# Altium project SDR2.PrjPcb (part 1 of 2)
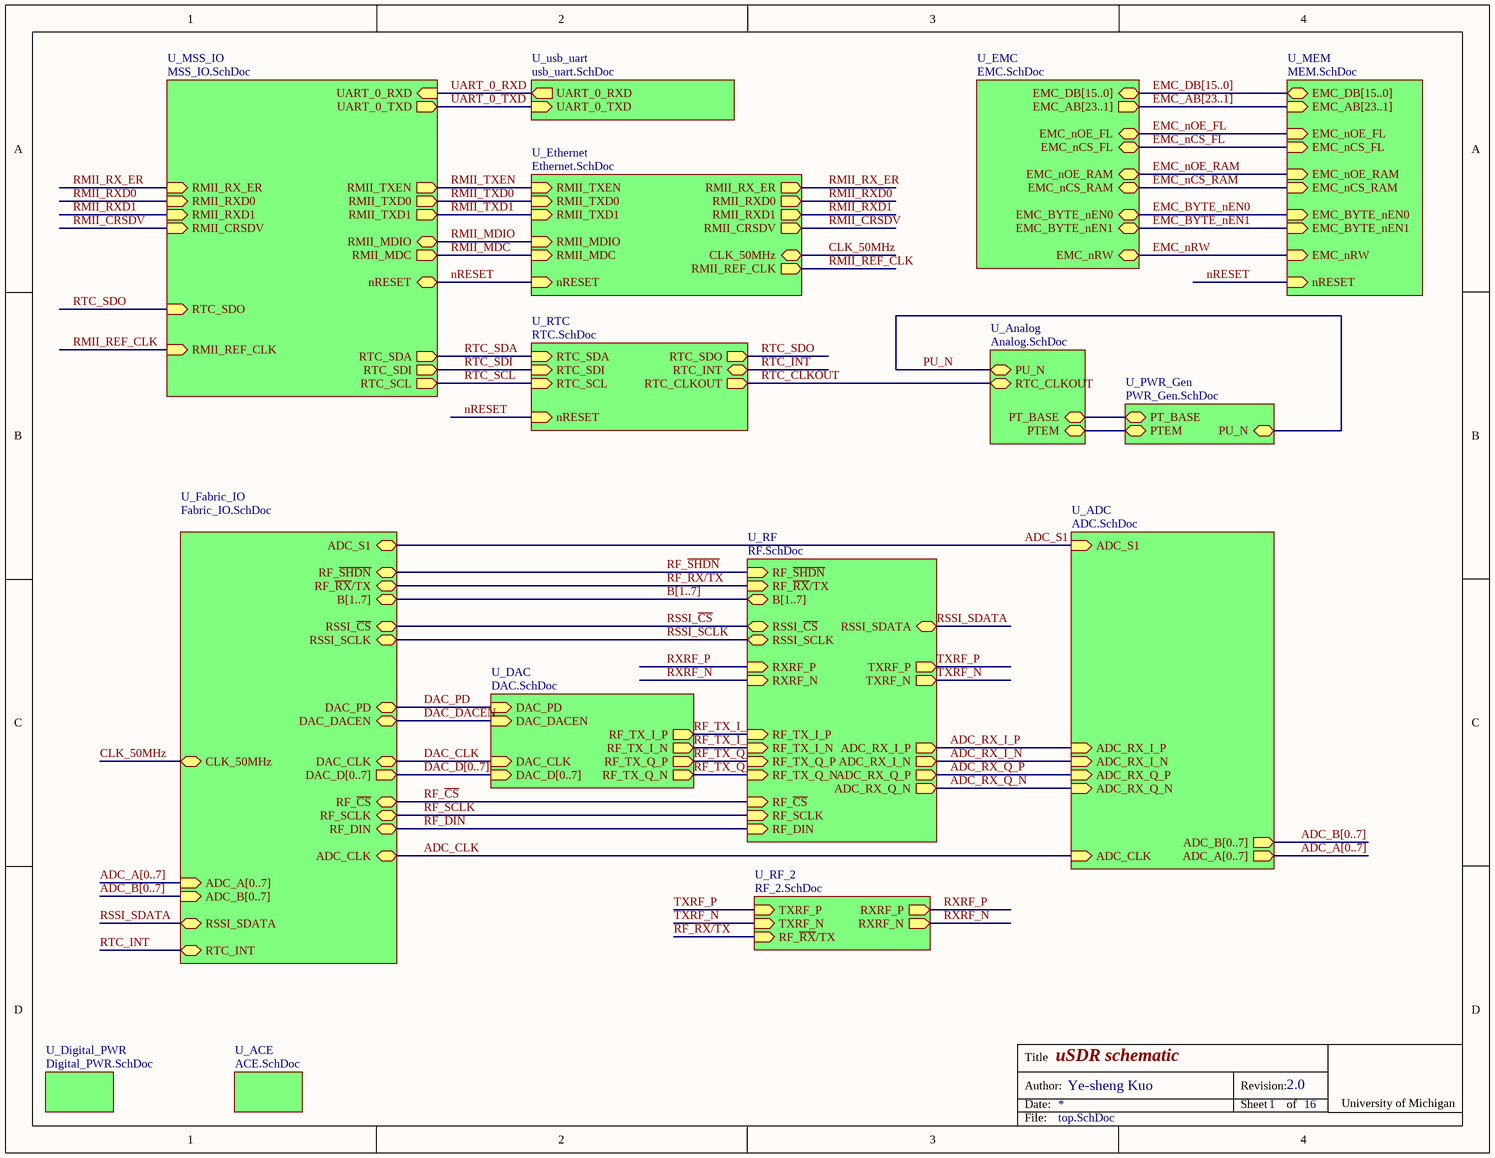
[diagram p0: top.SchDoc]
16 sheets, 401 parts. Net scope: hierarchical (ports join the sheet entries above them; power ports are global).
Board file: SDR.PcbDoc
Sheets:
  top.SchDoc
    U_EMC = EMC.SchDoc
    U_MEM = MEM.SchDoc
    U_Digital_PWR = Digital_PWR.SchDoc
    U_Analog = Analog.SchDoc
    U_usb_uart = usb_uart.SchDoc
    U_ACE = ACE.SchDoc
    U_Fabric_IO = Fabric_IO.SchDoc
    U_MSS_IO = MSS_IO.SchDoc
    U_ADC = ADC.SchDoc
    U_Ethernet = Ethernet.SchDoc
    U_DAC = DAC.SchDoc
    U_RF = RF.SchDoc
    U_PWR_Gen = PWR_Gen.SchDoc
    U_RF_2 = RF_2.SchDoc
    U_RTC = RTC.SchDoc

## Sheet top.SchDoc: uSDR schematic
size Letter; Author: Ye-sheng Kuo; CompanyName: Univ. of Michigan; DrawnBy: Ye-sheng Kuo; Revision: 2.0; SheetNumber: 1; SheetTotal: 16

### Sub-sheets
U_ACE = ACE.SchDoc: no entries
U_ADC = ADC.SchDoc: ADC_CLK (in), ADC_A[0..7] (out), ADC_B[0..7] (out), ADC_RX_Q_P (in), ADC_RX_Q_N (in), ADC_RX_I_N (in), ADC_RX_I_P (in), ADC_S1 (in)
U_Analog = Analog.SchDoc: PU_N, PT_BASE, PTEM, RTC_CLKOUT
U_DAC = DAC.SchDoc: DAC_D[0..7] (in), DAC_CLK (in), DAC_DACEN (in), DAC_PD (in), RF_TX_I_P (out), RF_TX_I_N (out), RF_TX_Q_P (out), RF_TX_Q_N (out)
U_Digital_PWR = Digital_PWR.SchDoc: no entries
U_EMC = EMC.SchDoc: EMC_AB[23..1] (out), EMC_DB[15..0] (bidir), EMC_nOE_FL (bidir), EMC_nOE_RAM (bidir), EMC_nRW (bidir), EMC_nCS_FL (bidir), EMC_nCS_RAM (bidir), EMC_BYTE_nEN1 (bidir), EMC_BYTE_nEN0 (bidir)
U_Ethernet = Ethernet.SchDoc: RMII_TXD0 (in), RMII_TXD1 (in), RMII_RXD0 (out), RMII_RXD1 (out), RMII_CRSDV (out), RMII_RX_ER (out), RMII_MDIO (in), RMII_MDC (in), nRESET (in), RMII_TXEN (in), CLK_50MHz (bidir), RMII_REF_CLK (out)
U_Fabric_IO = Fabric_IO.SchDoc: DAC_D[0..7] (out), DAC_CLK (bidir), ADC_CLK (bidir), RF_SCLK (bidir), RF_DIN (bidir), CLK_50MHz (bidir), RF_~{CS} (bidir), ADC_A[0..7] (in), ADC_B[0..7] (in), DAC_PD (bidir), DAC_DACEN (bidir), RF_~{RX}/TX (bidir), ADC_S1 (bidir), RF_~{SHDN} (bidir), B[1..7] (bidir), RSSI_SCLK (bidir), RSSI_~{CS} (bidir), RSSI_SDATA (bidir), RTC_INT (bidir)
U_MEM = MEM.SchDoc: EMC_nCS_RAM (in), EMC_nRW (in), EMC_nOE_RAM (in), EMC_BYTE_nEN1 (in), EMC_BYTE_nEN0 (in), EMC_nOE_FL (in), EMC_nCS_FL (in), EMC_AB[23..1] (in), EMC_DB[15..0] (bidir), nRESET (in)
U_MSS_IO = MSS_IO.SchDoc: UART_0_RXD (in), UART_0_TXD (out), nRESET (bidir), RMII_TXD0 (out), RMII_TXD1 (out), RMII_RXD0 (in), RMII_RXD1 (in), RMII_RX_ER (in), RMII_MDIO (bidir), RMII_MDC (out), RMII_TXEN (out), RMII_CRSDV (in), RMII_REF_CLK (in), RTC_SDI (out), RTC_SDO (in), RTC_SCL (out), RTC_SDA (out)
U_PWR_Gen = PWR_Gen.SchDoc: PTEM, PT_BASE, PU_N
U_RF = RF.SchDoc: RF_~{SHDN} (in), RF_~{CS} (in), RF_SCLK (in), RF_DIN (in), ADC_RX_Q_N (out), RF_~{RX}/TX (in), RF_TX_I_P (in), RF_TX_I_N (in), RF_TX_Q_P (in), RF_TX_Q_N (in), ADC_RX_I_P (out), ADC_RX_I_N (out), ADC_RX_Q_P (out), RXRF_N (in), RXRF_P (in), TXRF_P (out), TXRF_N (out), RSSI_~{CS} (bidir), RSSI_SDATA (bidir), RSSI_SCLK (bidir), B[1..7] (bidir)
U_RF_2 = RF_2.SchDoc: RF_~{RX}/TX (in), TXRF_N (in), TXRF_P (in), RXRF_P (out), RXRF_N (out)
U_RTC = RTC.SchDoc: RTC_SDA (in), RTC_SDO (out), RTC_SDI (in), RTC_SCL (in), RTC_INT (bidir), RTC_CLKOUT, nRESET (in)
U_usb_uart = usb_uart.SchDoc: UART_0_TXD (in), UART_0_RXD (out)

### Nets
ADC_CLK: sheet U_Fabric_IO/ADC_CLK, sheet U_ADC/ADC_CLK
ADC_RX_I_N: sheet U_ADC/ADC_RX_I_N, sheet U_RF/ADC_RX_I_N
ADC_RX_I_P: sheet U_ADC/ADC_RX_I_P, sheet U_RF/ADC_RX_I_P
ADC_RX_Q_N: sheet U_ADC/ADC_RX_Q_N, sheet U_RF/ADC_RX_Q_N
ADC_RX_Q_P: sheet U_ADC/ADC_RX_Q_P, sheet U_RF/ADC_RX_Q_P
ADC_S1: sheet U_Fabric_IO/ADC_S1, sheet U_ADC/ADC_S1
CLK_50MHz: sheet U_Fabric_IO/CLK_50MHz, sheet U_Ethernet/CLK_50MHz
DAC_CLK: sheet U_Fabric_IO/DAC_CLK, sheet U_DAC/DAC_CLK
DAC_DACEN: sheet U_Fabric_IO/DAC_DACEN, sheet U_DAC/DAC_DACEN
DAC_PD: sheet U_Fabric_IO/DAC_PD, sheet U_DAC/DAC_PD
EMC_BYTE_nEN0: sheet U_EMC/EMC_BYTE_nEN0, sheet U_MEM/EMC_BYTE_nEN0
EMC_BYTE_nEN1: sheet U_EMC/EMC_BYTE_nEN1, sheet U_MEM/EMC_BYTE_nEN1
EMC_nCS_FL: sheet U_EMC/EMC_nCS_FL, sheet U_MEM/EMC_nCS_FL
EMC_nCS_RAM: sheet U_EMC/EMC_nCS_RAM, sheet U_MEM/EMC_nCS_RAM
EMC_nOE_FL: sheet U_EMC/EMC_nOE_FL, sheet U_MEM/EMC_nOE_FL
EMC_nOE_RAM: sheet U_EMC/EMC_nOE_RAM, sheet U_MEM/EMC_nOE_RAM
EMC_nRW: sheet U_EMC/EMC_nRW, sheet U_MEM/EMC_nRW
nRESET: sheet U_MEM/nRESET, sheet U_MSS_IO/nRESET, sheet U_Ethernet/nRESET, sheet U_RTC/nRESET
PU_N: sheet U_Analog/PU_N, sheet U_PWR_Gen/PU_N
RF_~{CS}: sheet U_Fabric_IO/RF_~{CS}, sheet U_RF/RF_~{CS}
RF_DIN: sheet U_Fabric_IO/RF_DIN, sheet U_RF/RF_DIN
RF_~{RX}/TX: sheet U_Fabric_IO/RF_~{RX}/TX, sheet U_RF/RF_~{RX}/TX, sheet U_RF_2/RF_~{RX}/TX
RF_~{SHDN}: sheet U_Fabric_IO/RF_~{SHDN}, sheet U_RF/RF_~{SHDN}
RF_SCLK: sheet U_Fabric_IO/RF_SCLK, sheet U_RF/RF_SCLK
RF_TX_I_N: sheet U_DAC/RF_TX_I_N, sheet U_RF/RF_TX_I_N
RF_TX_I_P: sheet U_DAC/RF_TX_I_P, sheet U_RF/RF_TX_I_P
RF_TX_Q_N: sheet U_DAC/RF_TX_Q_N, sheet U_RF/RF_TX_Q_N
RF_TX_Q_P: sheet U_DAC/RF_TX_Q_P, sheet U_RF/RF_TX_Q_P
RMII_CRSDV: sheet U_MSS_IO/RMII_CRSDV, sheet U_Ethernet/RMII_CRSDV
RMII_MDC: sheet U_MSS_IO/RMII_MDC, sheet U_Ethernet/RMII_MDC
RMII_MDIO: sheet U_MSS_IO/RMII_MDIO, sheet U_Ethernet/RMII_MDIO
RMII_REF_CLK: sheet U_MSS_IO/RMII_REF_CLK, sheet U_Ethernet/RMII_REF_CLK
RMII_RX_ER: sheet U_MSS_IO/RMII_RX_ER, sheet U_Ethernet/RMII_RX_ER
RMII_RXD0: sheet U_MSS_IO/RMII_RXD0, sheet U_Ethernet/RMII_RXD0
RMII_RXD1: sheet U_MSS_IO/RMII_RXD1, sheet U_Ethernet/RMII_RXD1
RMII_TXD0: sheet U_MSS_IO/RMII_TXD0, sheet U_Ethernet/RMII_TXD0
RMII_TXD1: sheet U_MSS_IO/RMII_TXD1, sheet U_Ethernet/RMII_TXD1
RMII_TXEN: sheet U_MSS_IO/RMII_TXEN, sheet U_Ethernet/RMII_TXEN
RSSI_~{CS}: sheet U_Fabric_IO/RSSI_~{CS}, sheet U_RF/RSSI_~{CS}
RSSI_SCLK: sheet U_Fabric_IO/RSSI_SCLK, sheet U_RF/RSSI_SCLK
RSSI_SDATA: sheet U_Fabric_IO/RSSI_SDATA, sheet U_RF/RSSI_SDATA
RTC_CLKOUT: sheet U_Analog/RTC_CLKOUT, sheet U_RTC/RTC_CLKOUT
RTC_INT: sheet U_Fabric_IO/RTC_INT, sheet U_RTC/RTC_INT
RTC_SCL: sheet U_MSS_IO/RTC_SCL, sheet U_RTC/RTC_SCL
RTC_SDA: sheet U_MSS_IO/RTC_SDA, sheet U_RTC/RTC_SDA
RTC_SDI: sheet U_MSS_IO/RTC_SDI, sheet U_RTC/RTC_SDI
RTC_SDO: sheet U_MSS_IO/RTC_SDO, sheet U_RTC/RTC_SDO
RXRF_N: sheet U_RF/RXRF_N, sheet U_RF_2/RXRF_N
RXRF_P: sheet U_RF/RXRF_P, sheet U_RF_2/RXRF_P
TXRF_N: sheet U_RF/TXRF_N, sheet U_RF_2/TXRF_N
TXRF_P: sheet U_RF/TXRF_P, sheet U_RF_2/TXRF_P
UART_0_RXD: sheet U_usb_uart/UART_0_RXD, sheet U_MSS_IO/UART_0_RXD
UART_0_TXD: sheet U_usb_uart/UART_0_TXD, sheet U_MSS_IO/UART_0_TXD
VCC1.5_INT: sheet U_Analog/PTEM, sheet U_PWR_Gen/PTEM
NetQ2_1: sheet U_Analog/PT_BASE, sheet U_PWR_Gen/PT_BASE

### Buses and harness runs
bus ADC_A[0..7] = sheet U_ADC/ADC_A[0..7]
bus ADC_A[0..7] = sheet U_Fabric_IO/ADC_A[0..7]
bus ADC_B[0..7] = sheet U_ADC/ADC_B[0..7]
bus ADC_B[0..7] = sheet U_Fabric_IO/ADC_B[0..7]
bus B[1..7] = sheet U_Fabric_IO/B[1..7] = sheet U_RF/B[1..7]
bus DAC_D[0..7] = sheet U_DAC/DAC_D[0..7] = sheet U_Fabric_IO/DAC_D[0..7]
bus EMC_AB[23..1] = sheet U_EMC/EMC_AB[23..1] = sheet U_MEM/EMC_AB[23..1]
bus EMC_DB[15..0] = sheet U_EMC/EMC_DB[15..0] = sheet U_MEM/EMC_DB[15..0]

### Notes on the sheet
- Title
- Date:
- Author:
- Revision:
- Sheet
- of
- University of Michigan
- File:

## Sheet EMC.SchDoc: uSDR schematic
size Letter; Author: Ye-sheng Kuo; CompanyName: Univ. of Michigan; Revision: 2.0; SheetNumber: 16; SheetTotal: 16
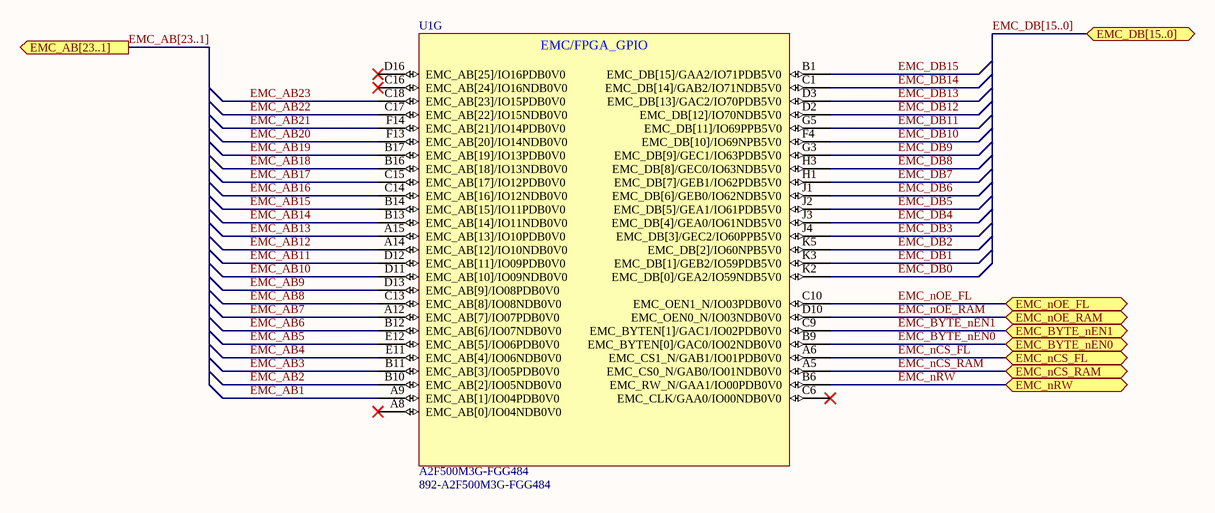
[diagram p1: EMC.SchDoc]

### Parts
U1  A2F500M3G-FGG484  Supplier Part Number 1: 892-A2F500M3G-FGG484  [BGA100P22X22-484N]  (part G of 13)

### Ports
EMC_AB[23..1] (out), EMC_BYTE_nEN0 (bidir), EMC_BYTE_nEN1 (bidir), EMC_DB[15..0] (bidir), EMC_nCS_FL (bidir), EMC_nCS_RAM (bidir), EMC_nOE_FL (bidir), EMC_nOE_RAM (bidir), EMC_nRW (bidir)

### Nets
EMC_AB1: U1.A9(EMC_AB[1]/IO04PDB0V0)
EMC_AB2: U1.B10(EMC_AB[2]/IO05NDB0V0)
EMC_AB3: U1.B11(EMC_AB[3]/IO05PDB0V0)
EMC_AB4: U1.E11(EMC_AB[4]/IO06NDB0V0)
EMC_AB5: U1.E12(EMC_AB[5]/IO06PDB0V0)
EMC_AB6: U1.B12(EMC_AB[6]/IO07NDB0V0)
EMC_AB7: U1.A12(EMC_AB[7]/IO07PDB0V0)
EMC_AB8: U1.C13(EMC_AB[8]/IO08NDB0V0)
EMC_AB9: U1.D13(EMC_AB[9]/IO08PDB0V0)
EMC_AB10: U1.D11(EMC_AB[10]/IO09NDB0V0)
EMC_AB11: U1.D12(EMC_AB[11]/IO09PDB0V0)
EMC_AB12: U1.A14(EMC_AB[12]/IO10NDB0V0)
EMC_AB13: U1.A15(EMC_AB[13]/IO10PDB0V0)
EMC_AB14: U1.B13(EMC_AB[14]/IO11NDB0V0)
EMC_AB15: U1.B14(EMC_AB[15]/IO11PDB0V0)
EMC_AB16: U1.C14(EMC_AB[16]/IO12NDB0V0)
EMC_AB17: U1.C15(EMC_AB[17]/IO12PDB0V0)
EMC_AB18: U1.B16(EMC_AB[18]/IO13NDB0V0)
EMC_AB19: U1.B17(EMC_AB[19]/IO13PDB0V0)
EMC_AB20: U1.F13(EMC_AB[20]/IO14NDB0V0)
EMC_AB21: U1.F14(EMC_AB[21]/IO14PDB0V0)
EMC_AB22: U1.C17(EMC_AB[22]/IO15NDB0V0)
EMC_AB23: U1.C18(EMC_AB[23]/IO15PDB0V0)
EMC_BYTE_nEN0: U1.B9(EMC_BYTEN[0]/GAC0/IO02NDB0V0) ; port EMC_BYTE_nEN0
EMC_BYTE_nEN1: U1.C9(EMC_BYTEN[1]/GAC1/IO02PDB0V0) ; port EMC_BYTE_nEN1
EMC_DB0: U1.K2(EMC_DB[0]/GEA2/IO59NDB5V0)
EMC_DB1: U1.K3(EMC_DB[1]/GEB2/IO59PDB5V0)
EMC_DB2: U1.K5(EMC_DB[2]/IO60NPB5V0)
EMC_DB3: U1.J4(EMC_DB[3]/GEC2/IO60PPB5V0)
EMC_DB4: U1.J3(EMC_DB[4]/GEA0/IO61NDB5V0)
EMC_DB5: U1.J2(EMC_DB[5]/GEA1/IO61PDB5V0)
EMC_DB6: U1.J1(EMC_DB[6]/GEB0/IO62NDB5V0)
EMC_DB7: U1.H1(EMC_DB[7]/GEB1/IO62PDB5V0)
EMC_DB8: U1.H3(EMC_DB[8]/GEC0/IO63NDB5V0)
EMC_DB9: U1.G3(EMC_DB[9]/GEC1/IO63PDB5V0)
EMC_DB10: U1.F4(EMC_DB[10]/IO69NPB5V0)
EMC_DB11: U1.G5(EMC_DB[11]/IO69PPB5V0)
EMC_DB12: U1.D2(EMC_DB[12]/IO70NDB5V0)
EMC_DB13: U1.D3(EMC_DB[13]/GAC2/IO70PDB5V0)
EMC_DB14: U1.C1(EMC_DB[14]/GAB2/IO71NDB5V0)
EMC_DB15: U1.B1(EMC_DB[15]/GAA2/IO71PDB5V0)
EMC_nCS_FL: U1.A6(EMC_CS1_N/GAB1/IO01PDB0V0) ; port EMC_nCS_FL
EMC_nCS_RAM: U1.A5(EMC_CS0_N/GAB0/IO01NDB0V0) ; port EMC_nCS_RAM
EMC_nOE_FL: U1.C10(EMC_OEN1_N/IO03PDB0V0) ; port EMC_nOE_FL
EMC_nOE_RAM: U1.D10(EMC_OEN0_N/IO03NDB0V0) ; port EMC_nOE_RAM
EMC_nRW: U1.B6(EMC_RW_N/GAA1/IO00PDB0V0) ; port EMC_nRW

Not connected (* = marked no-connect by the designer): U1 A8(EMC_AB[0]/IO04NDB0V0)* C6(EMC_CLK/GAA0/IO00NDB0V0)* C16(EMC_AB[24]/IO16NDB0V0)* D16(EMC_AB[25]/IO16PDB0V0)*

### Buses and harness runs
bus EMC_AB[23..1] = port EMC_AB[23..1]
bus EMC_DB[15..0] = port EMC_DB[15..0]

### Notes on the sheet
- Title
- Date:
- Author:
- Revision:
- Sheet
- of
- University of Michigan
- File:
- (in symbol F2-200_500-FGG484_1, part G) EMC/FPGA_GPIO

### Library data of the parts
U1 = F2-200_500-FGG484_1: FPGA - Field Programmable Gate Array 500K System Gates; PPS#: P0934R; Supplier 1: Mouser

## Sheet MEM.SchDoc: uSDR schematic
size Letter; Author: Ye-sheng Kuo; CompanyName: Univ. of Michigan; Revision: 2.0; SheetNumber: 15; SheetTotal: 16
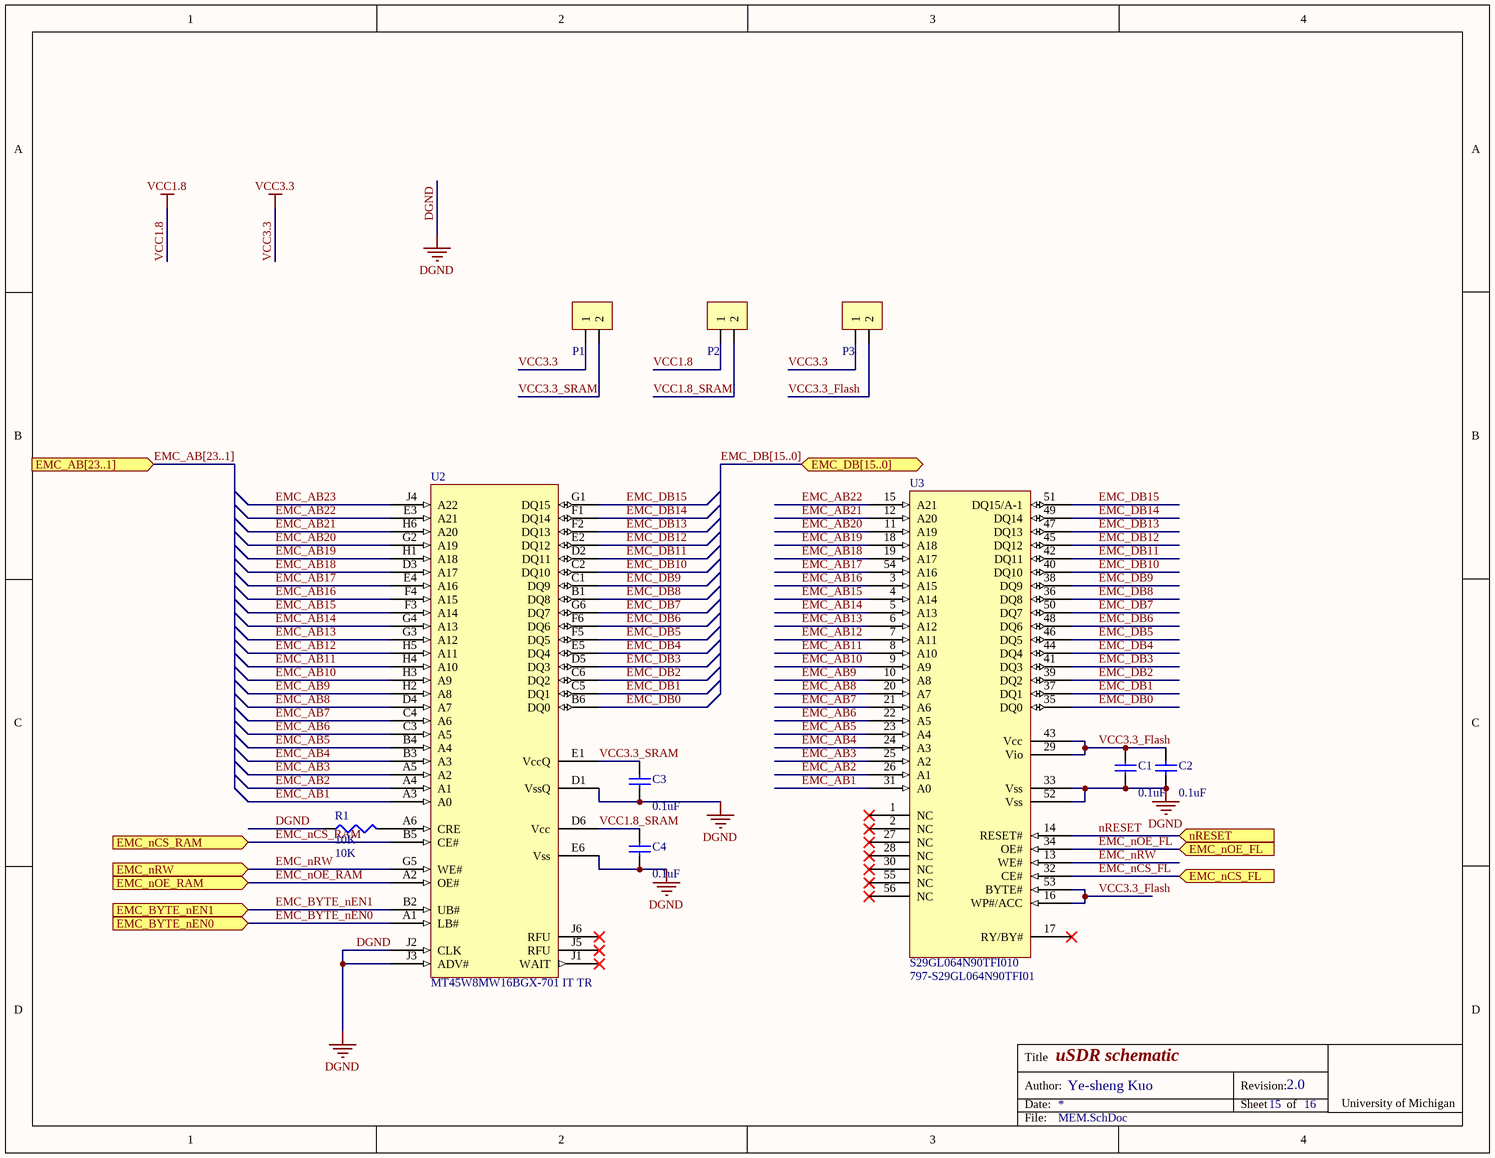
[diagram p2: MEM.SchDoc]

### Parts
C1  0.1uF  [0402]
C2  0.1uF  [0402]
C3  0.1uF  [0402]
C4  0.1uF  [0402]
P1  1 x 2 header  [1x2 header]  (value not drawn)
P2  1 x 2 header  [1x2 header]  (value not drawn)
P3  1 x 2 header  [1x2 header]  (value not drawn)
R1  10K  [0402]
U2  MT45W8MW16BGX-701 IT TR  [BGA54C75P9X6_1000X800X70]
U3  S29GL064N90TFI010  Supplier Part Number 1: 797-S29GL064N90TFI01  [TSSOP50P2000X120-56N]

### Ports
EMC_AB[23..1] (in), EMC_BYTE_nEN0 (in), EMC_BYTE_nEN1 (in), EMC_DB[15..0] (bidir), EMC_nCS_FL (in), EMC_nCS_RAM (in), EMC_nOE_FL (in), EMC_nOE_RAM (in), EMC_nRW (in), nRESET (in)

### Nets
DGND: C1.1 C2.1 C3.1 C4.1 R1.1 U2.D1(VssQ) U2.E6(Vss) U2.J2(CLK) U2.J3(ADV#) U3.33(Vss) U3.52(Vss)
VCC1.8: P2.1
VCC3.3: P1.1 P3.1
EMC_AB1: U2.A3(A0) U3.31(A0)
EMC_AB2: U2.A4(A1) U3.26(A1)
EMC_AB3: U2.A5(A2) U3.25(A2)
EMC_AB4: U2.B3(A3) U3.24(A3)
EMC_AB5: U2.B4(A4) U3.23(A4)
EMC_AB6: U2.C3(A5) U3.22(A5)
EMC_AB7: U2.C4(A6) U3.21(A6)
EMC_AB8: U2.D4(A7) U3.20(A7)
EMC_AB9: U2.H2(A8) U3.10(A8)
EMC_AB10: U2.H3(A9) U3.9(A9)
EMC_AB11: U2.H4(A10) U3.8(A10)
EMC_AB12: U2.H5(A11) U3.7(A11)
EMC_AB13: U2.G3(A12) U3.6(A12)
EMC_AB14: U2.G4(A13) U3.5(A13)
EMC_AB15: U2.F3(A14) U3.4(A14)
EMC_AB16: U2.F4(A15) U3.3(A15)
EMC_AB17: U2.E4(A16) U3.54(A16)
EMC_AB18: U2.D3(A17) U3.19(A17)
EMC_AB19: U2.H1(A18) U3.18(A18)
EMC_AB20: U2.G2(A19) U3.11(A19)
EMC_AB21: U2.H6(A20) U3.12(A20)
EMC_AB22: U2.E3(A21) U3.15(A21)
EMC_AB23: U2.J4(A22)
EMC_BYTE_nEN0: U2.A1(LB#) ; port EMC_BYTE_nEN0
EMC_BYTE_nEN1: U2.B2(UB#) ; port EMC_BYTE_nEN1
EMC_DB0: U2.B6(DQ0) U3.35(DQ0)
EMC_DB1: U2.C5(DQ1) U3.37(DQ1)
EMC_DB2: U2.C6(DQ2) U3.39(DQ2)
EMC_DB3: U2.D5(DQ3) U3.41(DQ3)
EMC_DB4: U2.E5(DQ4) U3.44(DQ4)
EMC_DB5: U2.F5(DQ5) U3.46(DQ5)
EMC_DB6: U2.F6(DQ6) U3.48(DQ6)
EMC_DB7: U2.G6(DQ7) U3.50(DQ7)
EMC_DB8: U2.B1(DQ8) U3.36(DQ8)
EMC_DB9: U2.C1(DQ9) U3.38(DQ9)
EMC_DB10: U2.C2(DQ10) U3.40(DQ10)
EMC_DB11: U2.D2(DQ11) U3.42(DQ11)
EMC_DB12: U2.E2(DQ12) U3.45(DQ12)
EMC_DB13: U2.F2(DQ13) U3.47(DQ13)
EMC_DB14: U2.F1(DQ14) U3.49(DQ14)
EMC_DB15: U2.G1(DQ15) U3.51(DQ15/A-1)
EMC_nCS_FL: U3.32(CE#) ; port EMC_nCS_FL
EMC_nCS_RAM: U2.B5(CE#) ; port EMC_nCS_RAM
EMC_nOE_FL: U3.34(OE#) ; port EMC_nOE_FL
EMC_nOE_RAM: U2.A2(OE#) ; port EMC_nOE_RAM
EMC_nRW: U2.G5(WE#) U3.13(WE#) ; port EMC_nRW
nRESET: U3.14(RESET#) ; port nRESET
VCC1.8_SRAM: C4.2 P2.2 U2.D6(Vcc)
VCC3.3_Flash: C1.2 C2.2 P3.2 U3.16(WP#/ACC) U3.29(Vio) U3.43(Vcc) U3.53(BYTE#)
VCC3.3_SRAM: C3.2 P1.2 U2.E1(VccQ)
NetR1_2: R1.2 U2.A6(CRE)

Not connected (* = marked no-connect by the designer): U2 J1(WAIT)* J5(RFU)* J6(RFU)*; U3 1(NC)* 2(NC)* 17(RY/BY#)* 27(NC)* 28(NC)* 30(NC)* 55(NC)* 56(NC)*

### Buses and harness runs
bus EMC_AB[23..1] = port EMC_AB[23..1]
bus EMC_DB[15..0] = port EMC_DB[15..0]

### Notes on the sheet
- Title
- Date:
- Author:
- Revision:
- Sheet
- of
- University of Michigan
- File:

### Library data of the parts
C1-C4 = Cap Semi: Capacitor (Semiconductor SIM Model); Published: 8-Jun-2000; LatestRevisionDate: 29-May-2009; LatestRevisionNote: IPC-7351 Footprint Added.; PackageReference: C1206; Publisher: Altium Limited; PackageDescription: Chip Capacitor; Value: 0.1uF
P1-P3 = 1 x 2 header: 100 mils standard header
R1 = Res3: Resistor; Published: 8-Jun-2000; LatestRevisionDate: 29-May-2009; LatestRevisionNote: IPC-7351 Footprint Added.; PackageReference: J1-0603; Publisher: Altium Limited; PackageDescription: Chip Resistor; Value: 10K
U2 = MT45W8MW16BGX-701 IT: IC PSRAM 128MBIT 70NS 54VFBGA; Supplier 1: Digi-Key; Supplier Part Number 1: 557-1444-1-ND
U3 = S29GL064N: Flash 3V 64Mb Float Gate highest address 90s; Supplier 1: Mouser

## Sheet Digital_PWR.SchDoc: uSDR schematic
size Letter; Author: Ye-sheng Kuo; CompanyName: Univ. of Michigan; Revision: 2.0; SheetNumber: 12; SheetTotal: 16
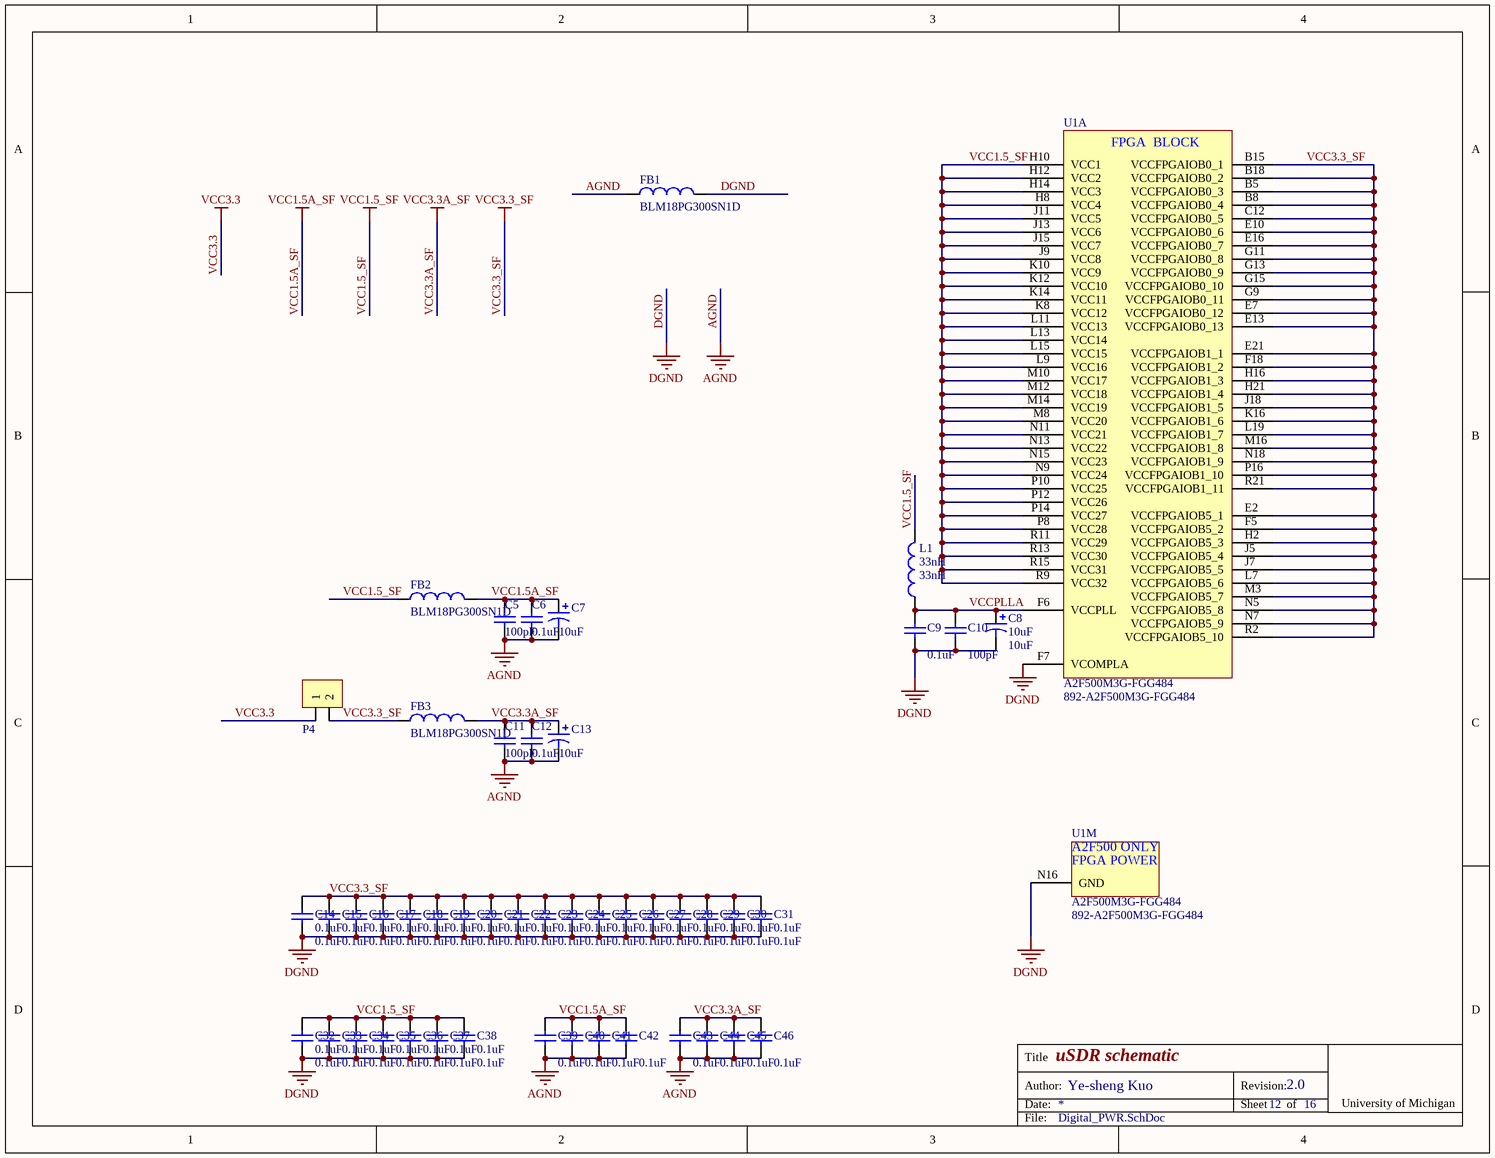
[diagram p3: Digital_PWR.SchDoc]

### Parts
C5  100pF  [0402]
C6  0.1uF  [0402]
C7  10uF  [C0805]
C8  10uF  [C0805]
C9  0.1uF  [0402]
C10  100pF  [0402]
C11  100pF  [0402]
C12  0.1uF  [0402]
C13  10uF  [C0805]
C14  0.1uF  [0402]
C15  0.1uF  [0402]
C16  0.1uF  [0402]
C17  0.1uF  [0402]
C18  0.1uF  [0402]
C19  0.1uF  [0402]
C20  0.1uF  [0402]
C21  0.1uF  [0402]
C22  0.1uF  [0402]
C23  0.1uF  [0402]
C24  0.1uF  [0402]
C25  0.1uF  [0402]
C26  0.1uF  [0402]
C27  0.1uF  [0402]
C28  0.1uF  [0402]
C29  0.1uF  [0402]
C30  0.1uF  [0402]
C31  0.1uF  [0402]
C32  0.1uF  [0402]
C33  0.1uF  [0402]
C34  0.1uF  [0402]
C35  0.1uF  [0402]
C36  0.1uF  [0402]
C37  0.1uF  [0402]
C38  0.1uF  [0402]
C39  0.1uF  [0402]
C40  0.1uF  [0402]
C41  0.1uF  [0402]
C42  0.1uF  [0402]
C43  0.1uF  [0402]
C44  0.1uF  [0402]
C45  0.1uF  [0402]
C46  0.1uF  [0402]
FB1  BLM18PG300SN1D  [1608[0603]]
FB2  BLM18PG300SN1D  [1608[0603]]
FB3  BLM18PG300SN1D  [1608[0603]]
L1  33nH  [0402]
P4  1 x 2 header  [1x2 header]  (value not drawn)
U1  A2F500M3G-FGG484  Supplier Part Number 1: 892-A2F500M3G-FGG484  [BGA100P22X22-484N]  (parts A,M of 13)

### Nets
AGND: C5.1 C6.1 C7.2 C11.1 C12.1 C13.2 C39.1 C40.1 C41.1 C42.1 C43.1 C44.1 C45.1 C46.1 FB1.1
DGND: C8.2 C9.1 C10.1 C14.1 C15.1 C16.1 C17.1 C18.1 C19.1 C20.1 C21.1 C22.1 C23.1 C24.1 C25.1 C26.1 C27.1 C28.1 C29.1 C30.1 C31.1 C32.1 C33.1 C34.1 C35.1 C36.1 C37.1 C38.1 FB1.2 U1.F7(VCOMPLA) U1.N16(GND)
VCC1.5_SF: C32.2 C33.2 C34.2 C35.2 C36.2 C37.2 C38.2 FB2.1 L1.2 U1.H8(VCC4) U1.H10(VCC1) U1.H12(VCC2) U1.H14(VCC3) U1.J9(VCC8) U1.J11(VCC5) U1.J13(VCC6) U1.J15(VCC7) U1.K8(VCC12) U1.K10(VCC9) U1.K12(VCC10) U1.K14(VCC11) U1.L9(VCC16) U1.L11(VCC13) U1.L13(VCC14) U1.L15(VCC15) U1.M8(VCC20) U1.M10(VCC17) U1.M12(VCC18) U1.M14(VCC19) U1.N9(VCC24) U1.N11(VCC21) U1.N13(VCC22) U1.N15(VCC23) U1.P8(VCC28) U1.P10(VCC25) U1.P12(VCC26) U1.P14(VCC27) U1.R9(VCC32) U1.R11(VCC29) U1.R13(VCC30) U1.R15(VCC31)
VCC1.5A_SF: C5.2 C6.2 C7.1 C39.2 C40.2 C41.2 C42.2 FB2.2
VCC3.3: P4.1
VCC3.3_SF: C14.2 C15.2 C16.2 C17.2 C18.2 C19.2 C20.2 C21.2 C22.2 C23.2 C24.2 C25.2 C26.2 C27.2 C28.2 C29.2 C30.2 C31.2 FB3.1 P4.2 U1.B5(VCCFPGAIOB0_3) U1.B8(VCCFPGAIOB0_4) U1.B15(VCCFPGAIOB0_1) U1.B18(VCCFPGAIOB0_2) U1.C12(VCCFPGAIOB0_5) U1.E2(VCCFPGAIOB5_1) U1.E7(VCCFPGAIOB0_12) U1.E10(VCCFPGAIOB0_6) U1.E13(VCCFPGAIOB0_13) U1.E16(VCCFPGAIOB0_7) U1.E21(VCCFPGAIOB1_1) U1.F5(VCCFPGAIOB5_2) U1.F18(VCCFPGAIOB1_2) U1.G9(VCCFPGAIOB0_11) U1.G11(VCCFPGAIOB0_8) U1.G13(VCCFPGAIOB0_9) U1.G15(VCCFPGAIOB0_10) U1.H2(VCCFPGAIOB5_3) U1.H16(VCCFPGAIOB1_3) U1.H21(VCCFPGAIOB1_4) U1.J5(VCCFPGAIOB5_4) U1.J7(VCCFPGAIOB5_5) U1.J18(VCCFPGAIOB1_5) U1.K16(VCCFPGAIOB1_6) U1.L7(VCCFPGAIOB5_6) U1.L19(VCCFPGAIOB1_7) U1.M3(VCCFPGAIOB5_7) U1.M16(VCCFPGAIOB1_8) U1.N5(VCCFPGAIOB5_8) U1.N7(VCCFPGAIOB5_9) U1.N18(VCCFPGAIOB1_9) U1.P16(VCCFPGAIOB1_10) U1.R2(VCCFPGAIOB5_10) U1.R21(VCCFPGAIOB1_11)
VCC3.3A_SF: C11.2 C12.2 C13.1 C43.2 C44.2 C45.2 C46.2 FB3.2
VCCPLLA: C8.1 C9.2 C10.2 L1.1 U1.F6(VCCPLL)

### Notes on the sheet
- Title
- Date:
- Author:
- Revision:
- Sheet
- of
- University of Michigan
- File:
- (in symbol F2-200_500-FGG484_1, part A) FPGA  BLOCK
- (in symbol F2-200_500-FGG484_1, part M) A2F500 ONLY; FPGA POWER

### Library data of the parts
C5 C6 C9-C12 C14-C46 = Cap Semi: Capacitor (Semiconductor SIM Model); Published: 8-Jun-2000; LatestRevisionDate: 29-May-2009; LatestRevisionNote: IPC-7351 Footprint Added.; PackageReference: C1206; Publisher: Altium Limited; PackageDescription: Chip Capacitor
  C5 C10 C11: Value: 100pF
  C6 C9 C12 C14-C46: Value: 0.1uF
C7 C8 C13 = Cap Pol3: Polarized Capacitor (Surface Mount); Published: 8-Jun-2000; LatestRevisionDate: 29-May-2009; LatestRevisionNote: IPC-7351 Footprint Added.; PackageReference: C0805; Publisher: Altium Limited; PackageDescription: Chip Capacitor; Value: 10uF
FB1-FB3 = Ferrite Bead: FERRITE CHIP 30 OHM 1000MA 0603; Supplier 1: Digi-Key; Supplier Part Number 1: 490-1035-2-ND
L1 = Inductor: Code_IEC: 1005; Published: 8-Jun-2000; LatestRevisionDate: 29-May-2009; LatestRevisionNote: IPC-7351 Footprint Added.; PackageReference: 0402-A; Publisher: Altium Limited; PackageDescription: Chip Inductor; Code_JEITA: 0402; Value: 33nH
P4 = 1 x 2 header: 100 mils standard header
U1 = F2-200_500-FGG484_1: as U1 on sheet EMC; Supplier 1: Mouser

## Sheet Analog.SchDoc: uSDR schematic
size Letter; Author: Ye-sheng Kuo; CompanyName: Univ. of Michigan; Revision: 2.0; SheetNumber: 13; SheetTotal: 16
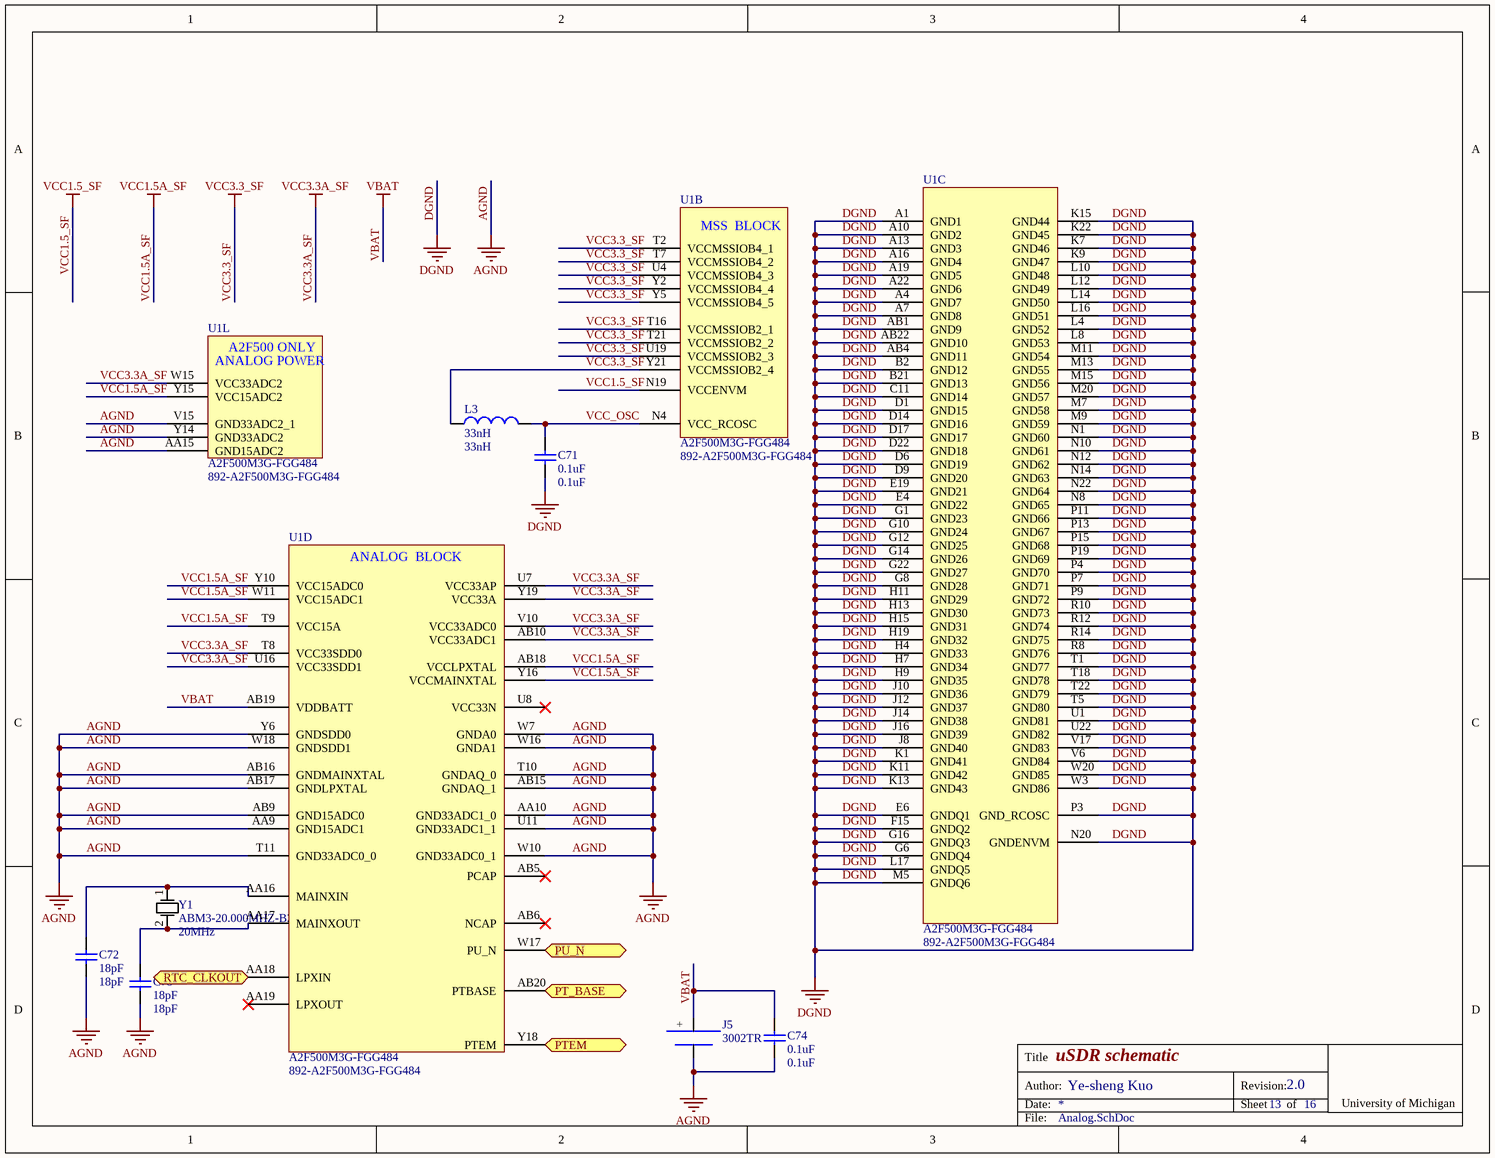
[diagram p4: Analog.SchDoc]

### Parts
C71  0.1uF  [0402]
C72  18pF  [0402]
C73  18pF  [0402]
C74  0.1uF  [0402]
J5  3002TR  [3002TR]
L3  33nH  [0402]
U1  A2F500M3G-FGG484  Supplier Part Number 1: 892-A2F500M3G-FGG484  [BGA100P22X22-484N]  (parts B,C,D,L of 13)
Y1  ABM3-20.000MHZ-B2-T  value 20MHz  [ABM3]

### Ports
PT_BASE, PTEM, PU_N, RTC_CLKOUT

### Nets
AGND: C72.1 C73.1 C74.1 J5.neg(-) U1.AA9(GND15ADC1) U1.AA10(GND33ADC1_0) U1.AA15(GND15ADC2) U1.AB9(GND15ADC0) U1.AB15(GNDAQ_1) U1.AB16(GNDMAINXTAL) U1.AB17(GNDLPXTAL) U1.T10(GNDAQ_0) U1.T11(GND33ADC0_0) U1.U11(GND33ADC1_1) U1.V15(GND33ADC2_1) U1.W7(GNDA0) U1.W10(GND33ADC0_1) U1.W16(GNDA1) U1.W18(GNDSDD1) U1.Y6(GNDSDD0) U1.Y14(GND33ADC2)
DGND: C71.1 U1.A1(GND1) U1.A4(GND7) U1.A7(GND8) U1.A10(GND2) U1.A13(GND3) U1.A16(GND4) U1.A19(GND5) U1.A22(GND6) U1.AB1(GND9) U1.AB4(GND11) U1.AB22(GND10) U1.B2(GND12) U1.B21(GND13) U1.C11(GND14) U1.D1(GND15) U1.D6(GND19) U1.D9(GND20) U1.D14(GND16) U1.D17(GND17) U1.D22(GND18) U1.E4(GND22) U1.E6(GNDQ1) U1.E19(GND21) U1.F15(GNDQ2) U1.G1(GND23) U1.G6(GNDQ4) U1.G8(GND28) U1.G10(GND24) U1.G12(GND25) U1.G14(GND26) U1.G16(GNDQ3) U1.G22(GND27) U1.H4(GND33) U1.H7(GND34) U1.H9(GND35) U1.H11(GND29) U1.H13(GND30) U1.H15(GND31) U1.H19(GND32) U1.J8(GND40) U1.J10(GND36) U1.J12(GND37) U1.J14(GND38) U1.J16(GND39) U1.K1(GND41) U1.K7(GND46) U1.K9(GND47) U1.K11(GND42) U1.K13(GND43) U1.K15(GND44) U1.K22(GND45) U1.L4(GND52) U1.L8(GND53) U1.L10(GND48) U1.L12(GND49) U1.L14(GND50) U1.L16(GND51) U1.L17(GNDQ5) U1.M5(GNDQ6) U1.M7(GND58) U1.M9(GND59) U1.M11(GND54) U1.M13(GND55) U1.M15(GND56) U1.M20(GND57) U1.N1(GND60) U1.N8(GND65) U1.N10(GND61) U1.N12(GND62) U1.N14(GND63) U1.N20(GNDENVM) U1.N22(GND64) U1.P3(GND_RCOSC) U1.P4(GND70) U1.P7(GND71) U1.P9(GND72) U1.P11(GND66) U1.P13(GND67) U1.P15(GND68) U1.P19(GND69) U1.R8(GND76) U1.R10(GND73) U1.R12(GND74) U1.R14(GND75) U1.T1(GND77) U1.T5(GND80) U1.T18(GND78) U1.T22(GND79) U1.U1(GND81) U1.U22(GND82) U1.V6(GND84) U1.V17(GND83) U1.W3(GND86) U1.W20(GND85)
VBAT: C74.2 J5.pos(+) U1.AB19(VDDBATT)
VCC1.5_SF: U1.N19(VCCENVM)
VCC1.5A_SF: U1.AB18(VCCLPXTAL) U1.T9(VCC15A) U1.W11(VCC15ADC1) U1.Y10(VCC15ADC0) U1.Y15(VCC15ADC2) U1.Y16(VCCMAINXTAL)
VCC3.3_SF: L3.1 U1.T2(VCCMSSIOB4_1) U1.T7(VCCMSSIOB4_2) U1.T16(VCCMSSIOB2_1) U1.T21(VCCMSSIOB2_2) U1.U4(VCCMSSIOB4_3) U1.U19(VCCMSSIOB2_3) U1.Y2(VCCMSSIOB4_4) U1.Y5(VCCMSSIOB4_5) U1.Y21(VCCMSSIOB2_4)
VCC3.3A_SF: U1.AB10(VCC33ADC1) U1.T8(VCC33SDD0) U1.U7(VCC33AP) U1.U16(VCC33SDD1) U1.V10(VCC33ADC0) U1.W15(VCC33ADC2) U1.Y19(VCC33A)
PU_N: U1.W17(PU_N) ; port PU_N
RTC_CLKOUT: U1.AA18(LPXIN) ; port RTC_CLKOUT
VCC1.5_INT: U1.Y18(PTEM) ; port PTEM
VCC_OSC: C71.2 L3.2 U1.N4(VCC_RCOSC)
NetC72_2: C72.2 U1.AA16(MAINXIN) Y1.1(HOT)
NetC73_2: C73.2 U1.AA17(MAINXOUT) Y1.2(HOT)
NetQ2_1: U1.AB20(PTBASE) ; port PT_BASE

Not connected (* = marked no-connect by the designer): U1 AA19(LPXOUT)* AB5(PCAP)* AB6(NCAP)* U8(VCC33N)*

### Notes on the sheet
- Title
- Date:
- Author:
- Revision:
- Sheet
- of
- University of Michigan
- File:
- (in symbol F2-200_500-FGG484_1, part B) MSS  BLOCK
- (in symbol F2-200_500-FGG484_1, part D) ANALOG  BLOCK
- (in symbol F2-200_500-FGG484_1, part L) A2F500 ONLY; ANALOG POWER

### Library data of the parts
C71-C74 = Cap Semi: Capacitor (Semiconductor SIM Model); Published: 8-Jun-2000; LatestRevisionDate: 29-May-2009; LatestRevisionNote: IPC-7351 Footprint Added.; PackageReference: C1206; Publisher: Altium Limited; PackageDescription: Chip Capacitor
  C71 C74: Value: 0.1uF
  C72 C73: Value: 18pF
J5 = 3002TR: HOLDER BATTERY COIN 20MM DIA SMD; datasheet: http://mail.keyelco.com/ENG._DEPT/PDF%20CAT%20NO%20Drawings/3002.pdf; Supplier 1: Digi-Key; Supplier Part Number 1: 3002KCT-ND
L3 = Inductor: Code_IEC: 1005; Published: 8-Jun-2000; LatestRevisionDate: 29-May-2009; LatestRevisionNote: IPC-7351 Footprint Added.; PackageReference: 0402-A; Publisher: Altium Limited; PackageDescription: Chip Inductor; Code_JEITA: 0402; Value: 33nH
U1 = F2-200_500-FGG484_1: as U1 on sheet EMC; Supplier 1: Mouser
Y1 = ABM3: CRYSTAL 20.000MHZ 18PF SMD; Supplier 1: Digi-Key; Supplier Part Number 1: 535-9105-1-ND

## Sheet usb_uart.SchDoc: uSDR schematic
size Letter; Author: Ye-sheng Kuo; CompanyName: Univ. of Michigan; Revision: 2.0; SheetNumber: 8; SheetTotal: 16
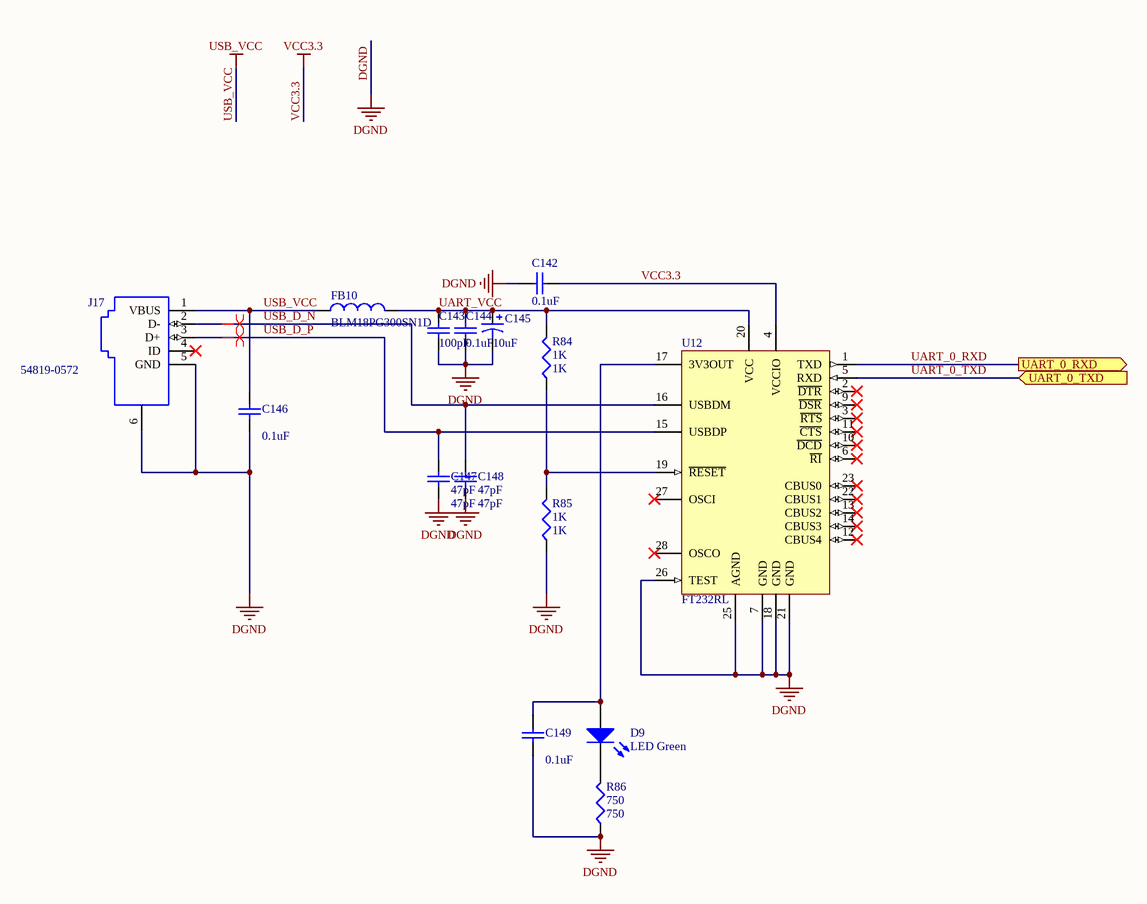
[diagram p5: usb_uart.SchDoc]

### Parts
C142  0.1uF  [0402]
C143  100pF  [0402]
C144  0.1uF  [0402]
C145  10uF  [C0805]
C146  0.1uF  [0402]
C147  47pF  [0402]
C148  47pF  [0402]
C149  0.1uF  [0402]
D9  LED Green  [1608[0603]]
FB10  BLM18PG300SN1D  [1608[0603]]
J17  54819-0572  [Mini USB]
R84  1K  [0402]
R85  1K  [0402]
R86  750  [0402]
U12  FT232RL  [SSOP65P780X200-28N]

### Ports
UART_0_RXD (out), UART_0_TXD (in)

### Nets
DGND: C142.1 C143.1 C144.1 C145.2 C146.1 C147.1 C148.1 C149.1 J17.5(GND) J17.6(SHIELD) R85.1 R86.1 U12.7(GND) U12.18(GND) U12.21(GND) U12.25(AGND) U12.26(TEST)
USB_VCC: C146.2 FB10.1 J17.1(VBUS)
VCC3.3: C142.2 U12.4(VCCIO)
UART_0_RXD: U12.1(TXD) ; port UART_0_RXD
UART_0_TXD: U12.5(RXD) ; port UART_0_TXD
UART_VCC: C143.2 C144.2 C145.1 FB10.2 R84.2 U12.20(VCC)
USB_D_N: C148.2 J17.2(D-) U12.16(USBDM)
USB_D_P: C147.2 J17.3(D+) U12.15(USBDP)
NetC149_2: C149.2 D9.1(A) U12.17(3V3OUT)
NetD9_2: D9.2(K) R86.2
NetR84_1: R84.1 R85.2 U12.19(~{RESET})

Not connected (* = marked no-connect by the designer): J17 4(ID)*; U12 2(~{DTR})* 3(~{RTS})* 6(~{RI})* 8(NC) 9(~{DSR})* 10(~{DCD})* 11(~{CTS})* 12(CBUS4)* 13(CBUS2)* 14(CBUS3)* 22(CBUS1)* 23(CBUS0)* 24(NC) 27(OSCI)* 28(OSCO)*

### Layout directives
differential pair: USB_D_N, USB_D_P

### Notes on the sheet
- Title
- Date:
- Author:
- Revision:
- Sheet
- of
- University of Michigan
- File:

### Library data of the parts
C142-C144 C146-C149 = Cap Semi: Capacitor (Semiconductor SIM Model); Published: 8-Jun-2000; LatestRevisionDate: 29-May-2009; LatestRevisionNote: IPC-7351 Footprint Added.; PackageReference: C1206; Publisher: Altium Limited; PackageDescription: Chip Capacitor
  C142 C144 C146 C149: Value: 0.1uF
  C143: Value: 100pF
  C147 C148: Value: 47pF
C145 = Cap Pol3: Polarized Capacitor (Surface Mount); Published: 8-Jun-2000; LatestRevisionDate: 29-May-2009; LatestRevisionNote: IPC-7351 Footprint Added.; PackageReference: C0805; Publisher: Altium Limited; PackageDescription: Chip Capacitor; Value: 10uF
D9 = LED2: Typical RED, GREEN, YELLOW, AMBER GaAs LED; Published: 8-Jun-2000; LatestRevisionDate: 17-Jul-2002; LatestRevisionNote: Re-released for DXP Platform.; PackageVersion: Feb-2002; PackageReference: 3.2X1.6X1.1; Publisher: Altium Limited; PackageDescription: SM LED; 2 Flat Leads
FB10 = Ferrite Bead: FERRITE CHIP 30 OHM 1000MA 0603; Supplier 1: Digi-Key; Supplier Part Number 1: 490-1035-2-ND
J17 = Mini USB: CONN RECEPT MINIUSB R/A 5POS SMD; Supplier 1: Digi-Key; Supplier Part Number 1: WM17116CT-ND
R84-R86 = Res3: Resistor; Published: 8-Jun-2000; LatestRevisionDate: 29-May-2009; LatestRevisionNote: IPC-7351 Footprint Added.; PackageReference: J1-0603; Publisher: Altium Limited; PackageDescription: Chip Resistor
  R84 R85: Value: 1K
  R86: Value: 750
U12 = FT232RL: USB to UART interface in SSOP-28 package; Manufacturer: Future Technology Devices International Ltd. (FTDI); Note: *; DigiKeyPartNo: 768-1007-1-ND; ManufacturerPartNo: FT232RL; ComponentLink1Description: Manufacturer Link; ComponentLink1URL: http://www.ftdichip.com/Products/FT232R.htm; ComponentLink2Description: Datasheet; ComponentLink2URL: http://www.ftdichip.com/Documents/DataSheets/DS_FT232R_V204.pdf; DatasheetVersion: ver 2.04, Jun-2009; LatestRevisionNote: IPC-7351 Footprint Added.; PackageReference: SSOP65P780X200-28N; PackageDescription: SSOP, 28-Leads, Body 10.3x5.6mm (max), Pitch 0.65mm, IPC Medium Density; PackageVersion: Jan-2011; Published: 27-Oct-2009; Publisher: FTDI Ltd.; Supplier 1: Digi-Key; Supplier 2: Newark; Supplier 3: Farnell; Supplier Part Number 1: 768-1007-2-ND; Supplier Part Number 2: 91K9918; Supplier Part Number 3: 1146032

## Sheet ACE.SchDoc: uSDR schematic
size Letter; Author: Ye-sheng Kuo; CompanyName: Univ. of Michigan; Revision: 2.0; SheetNumber: 14; SheetTotal: 16
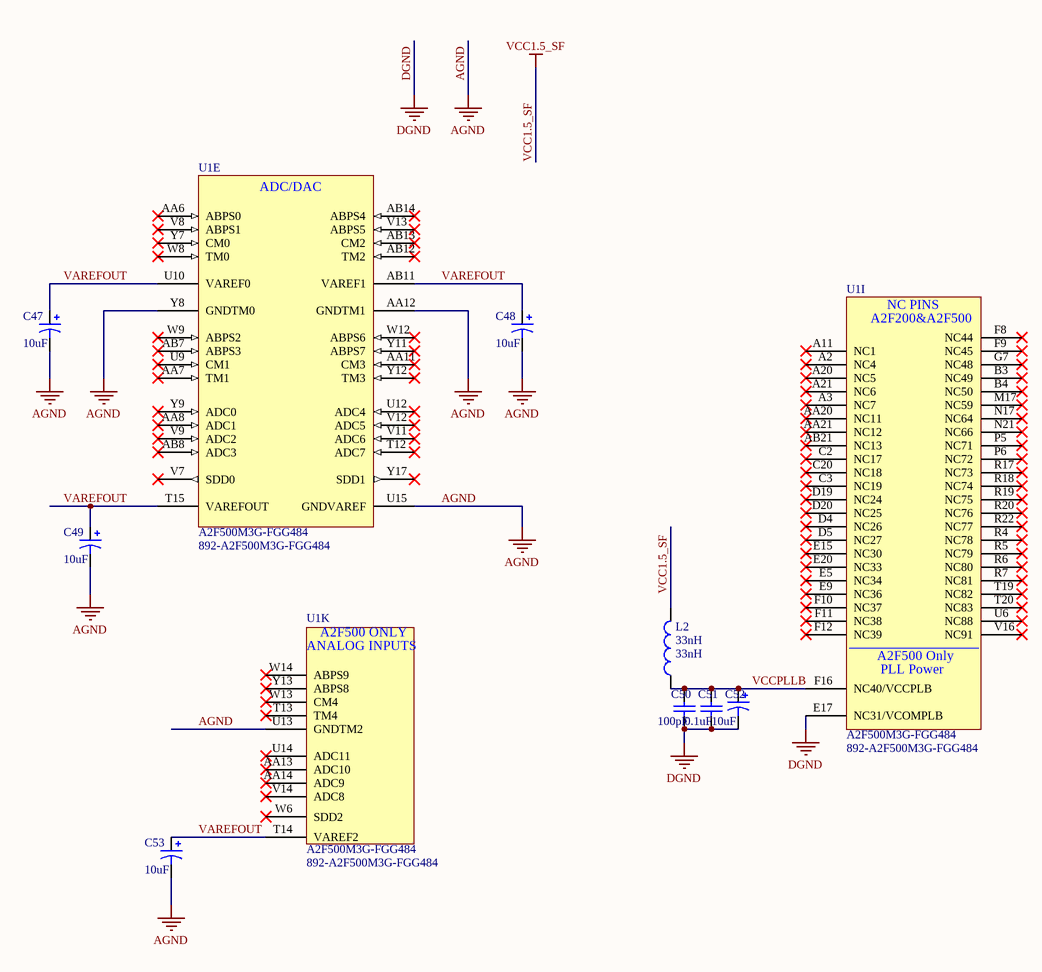
[diagram p6: ACE.SchDoc]

### Parts
C47  10uF  [C0805]
C48  10uF  [C0805]
C49  10uF  [C0805]
C50  100pF  [0402]
C51  0.1uF  [0402]
C52  10uF  [C0805]
C53  10uF  [C0805]
L2  33nH  [0402]
U1  A2F500M3G-FGG484  Supplier Part Number 1: 892-A2F500M3G-FGG484  [BGA100P22X22-484N]  (parts E,I,K of 13)

### Nets
AGND: C47.2 C48.2 C49.2 C53.2 U1.AA12(GNDTM1) U1.U13(GNDTM2) U1.U15(GNDVAREF) U1.Y8(GNDTM0)
DGND: C50.1 C51.1 C52.2 U1.E17(NC31/VCOMPLB)
VCC1.5_SF: L2.2
VAREFOUT: C47.1 C48.1 C49.1 C53.1 U1.AB11(VAREF1) U1.T14(VAREF2) U1.T15(VAREFOUT) U1.U10(VAREF0)
VCCPLLB: C50.2 C51.2 C52.1 L2.1 U1.F16(NC40/VCCPLB)

Not connected (* = marked no-connect by the designer): U1 A2(NC4)* A3(NC7)* A11(NC1)* A20(NC5)* A21(NC6)* AA6(ABPS0)* AA7(TM1)* AA8(ADC1)* AA11(CM3)* AA13(ADC10)* AA14(ADC9)* AA20(NC11)* AA21(NC12)* AB7(ABPS3)* AB8(ADC3)* AB12(TM2)* AB13(CM2)* AB14(ABPS4)* AB21(NC13)* B3(NC49)* B4(NC50)* C2(NC17)* C3(NC19)* C20(NC18)* D4(NC26)* D5(NC27)* D19(NC24)* D20(NC25)* E5(NC34)* E9(NC36)* E15(NC30)* E20(NC33)* F8(NC44)* F9(NC45)* F10(NC37)* F11(NC38)* F12(NC39)* G7(NC48)* M17(NC59)* N17(NC64)* N21(NC66)* P5(NC71)* P6(NC72)* R4(NC78)* R5(NC79)* R6(NC80)* R7(NC81)* R17(NC73)* R18(NC74)* R19(NC75)* R20(NC76)* R22(NC77)* T12(ADC7)* T13(TM4)* T19(NC82)* T20(NC83)* U6(NC88)* U9(CM1)* U12(ADC4)* U14(ADC11)* V7(SDD0)* V8(ABPS1)* V9(ADC2)* V11(ADC6)* V12(ADC5)* V13(ABPS5)* V14(ADC8)* V16(NC91)* W6(SDD2)* W8(TM0)* W9(ABPS2)* W12(ABPS6)* W13(CM4)* W14(ABPS9)* Y7(CM0)* Y9(ADC0)* Y11(ABPS7)* Y12(TM3)* Y13(ABPS8)* Y17(SDD1)*

### Notes on the sheet
- Title
- Date:
- Author:
- Revision:
- Sheet
- of
- University of Michigan
- File:
- (in symbol F2-200_500-FGG484_1, part E) ADC/DAC
- (in symbol F2-200_500-FGG484_1, part I) NC PINS; A2F200&A2F500; A2F500 Only; PLL Power
- (in symbol F2-200_500-FGG484_1, part K) A2F500 ONLY; ANALOG INPUTS

### Library data of the parts
C47-C49 C52 C53 = Cap Pol3: Polarized Capacitor (Surface Mount); Published: 8-Jun-2000; LatestRevisionDate: 29-May-2009; LatestRevisionNote: IPC-7351 Footprint Added.; PackageReference: C0805; Publisher: Altium Limited; PackageDescription: Chip Capacitor; Value: 10uF
C50 C51 = Cap Semi: Capacitor (Semiconductor SIM Model); Published: 8-Jun-2000; LatestRevisionDate: 29-May-2009; LatestRevisionNote: IPC-7351 Footprint Added.; PackageReference: C1206; Publisher: Altium Limited; PackageDescription: Chip Capacitor
  C50: Value: 100pF
  C51: Value: 0.1uF
L2 = Inductor: Code_IEC: 1005; Published: 8-Jun-2000; LatestRevisionDate: 29-May-2009; LatestRevisionNote: IPC-7351 Footprint Added.; PackageReference: 0402-A; Publisher: Altium Limited; PackageDescription: Chip Inductor; Code_JEITA: 0402; Value: 33nH
U1 = F2-200_500-FGG484_1: as U1 on sheet EMC; Supplier 1: Mouser

## Sheet Fabric_IO.SchDoc: uSDR schematic
size Letter; Author: Ye-sheng Kuo; CompanyName: Univ. of Michigan; Revision: 2.0; SheetNumber: 10; SheetTotal: 16
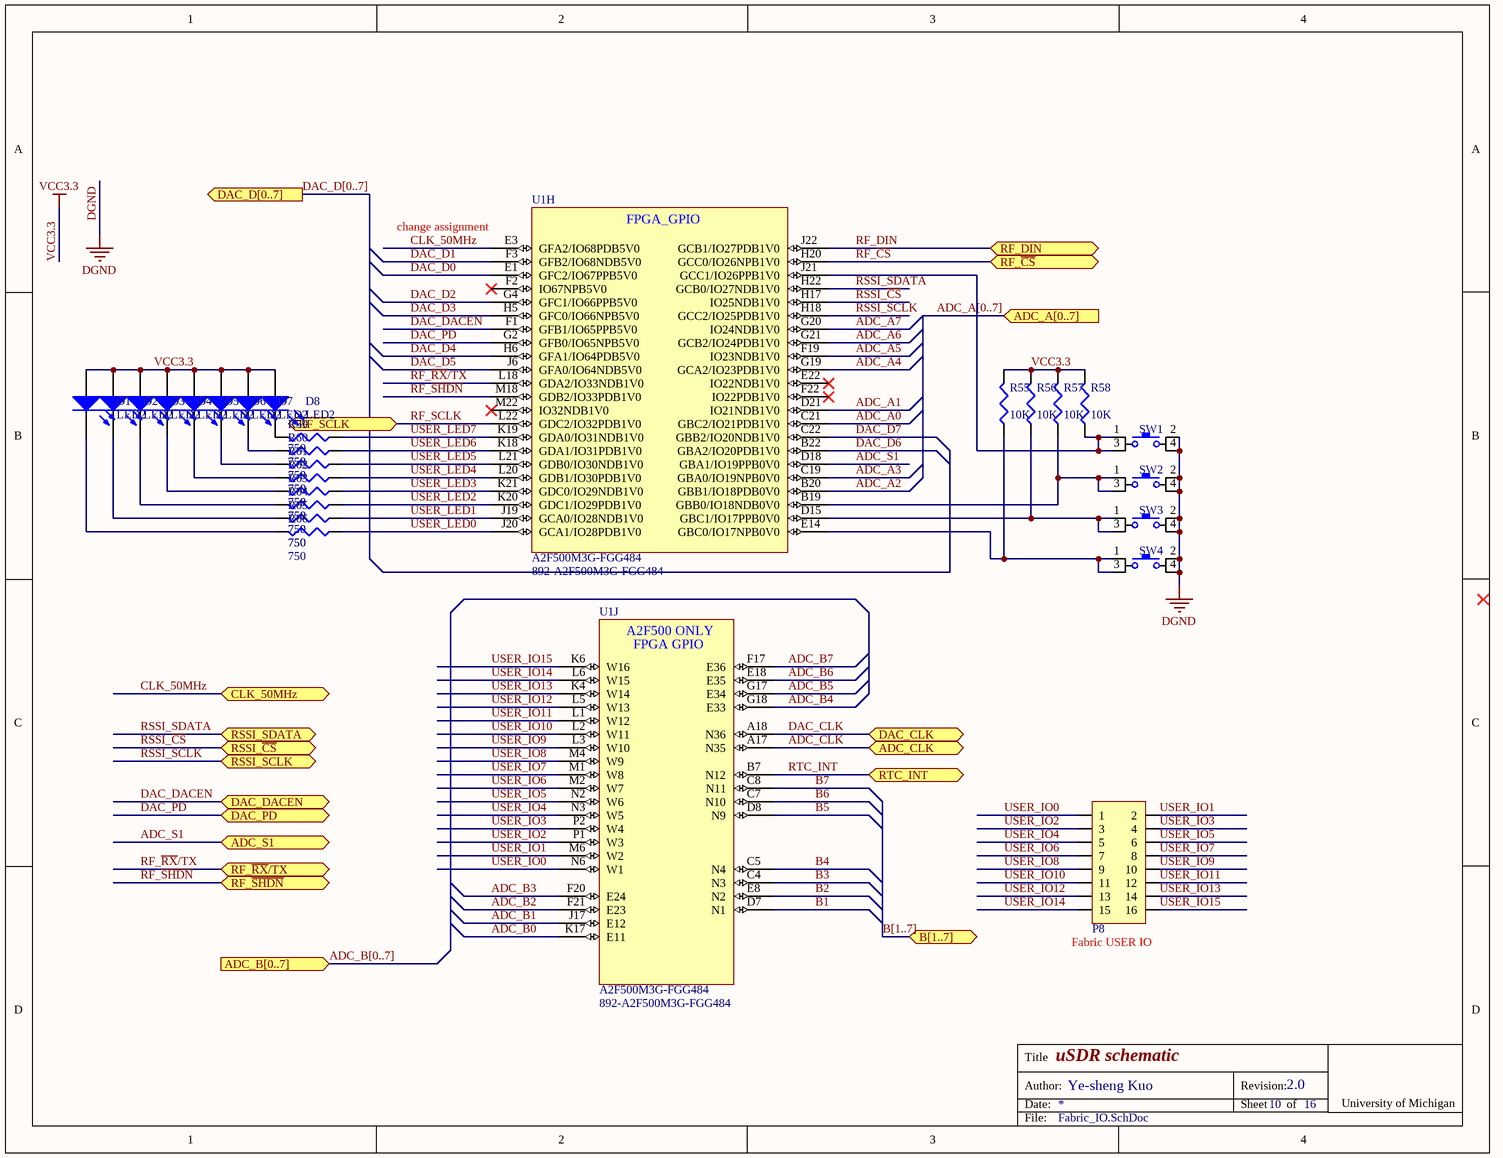
[diagram p7: Fabric_IO.SchDoc]

### Parts
D1  LED2  [1608[0603]]
D2  LED2  [1608[0603]]
D3  LED2  [1608[0603]]
D4  LED2  [1608[0603]]
D5  LED2  [1608[0603]]
D6  LED2  [1608[0603]]
D7  LED2  [1608[0603]]
D8  LED2  [1608[0603]]
P8  2 x 8 header  [2x8 header]  (value not drawn)
R55  10K  [0402]
R56  10K  [0402]
R57  10K  [0402]
R58  10K  [0402]
R59  750  [0402]
R60  750  [0402]
R61  750  [0402]
R62  750  [0402]
R63  750  [0402]
R64  750  [0402]
R65  750  [0402]
R66  750  [0402]
SW1  Switch 4-lead  [KSC403]  (value not drawn)
SW2  Switch 4-lead  [KSC403]  (value not drawn)
SW3  Switch 4-lead  [KSC403]  (value not drawn)
SW4  Switch 4-lead  [KSC403]  (value not drawn)
U1  A2F500M3G-FGG484  Supplier Part Number 1: 892-A2F500M3G-FGG484  [BGA100P22X22-484N]  (parts H,J of 13)

### Ports
ADC_A[0..7] (in), ADC_B[0..7] (in), ADC_CLK (bidir), ADC_S1 (bidir), B[1..7] (bidir), CLK_50MHz (bidir), DAC_CLK (bidir), DAC_D[0..7] (out), DAC_DACEN (bidir), DAC_PD (bidir), RF_DIN (bidir), RF_SCLK (bidir), RF_~{CS} (bidir), RF_~{RX}/TX (bidir), RF_~{SHDN} (bidir), RSSI_SCLK (bidir), RSSI_SDATA (bidir), RSSI_~{CS} (bidir), RTC_INT (bidir)

### Nets
DGND: SW1.2 SW1.4 SW2.2 SW2.4 SW3.2 SW3.4 SW4.2 SW4.4
VCC3.3: D1.1(A) D2.1(A) D3.1(A) D4.1(A) D5.1(A) D6.1(A) D7.1(A) D8.1(A) R55.2 R56.2 R57.2 R58.2
ADC_A0: U1.C21(GBC2/IO21PDB1V0)
ADC_A1: U1.D21(IO21NDB1V0)
ADC_A2: U1.B20(GBB1/IO18PDB0V0)
ADC_A3: U1.C19(GBA0/IO19NPB0V0)
ADC_A4: U1.G19(GCA2/IO23PDB1V0)
ADC_A5: U1.F19(IO23NDB1V0)
ADC_A6: U1.G21(GCB2/IO24PDB1V0)
ADC_A7: U1.G20(IO24NDB1V0)
ADC_B0: U1.K17(E11)
ADC_B1: U1.J17(E12)
ADC_B2: U1.F21(E23)
ADC_B3: U1.F20(E24)
ADC_B4: U1.G18(E33)
ADC_B5: U1.G17(E34)
ADC_B6: U1.E18(E35)
ADC_B7: U1.F17(E36)
ADC_CLK: U1.A17(N35) ; port ADC_CLK
ADC_S1: U1.D18(GBA1/IO19PPB0V0) ; port ADC_S1
B1: U1.D7(N1)
B2: U1.E8(N2)
B3: U1.C4(N3)
B4: U1.C5(N4)
B5: U1.D8(N9)
B6: U1.C7(N10)
B7: U1.C8(N11)
CLK_50MHz: U1.E3(GFA2/IO68PDB5V0) ; port CLK_50MHz
DAC_CLK: U1.A18(N36) ; port DAC_CLK
DAC_D0: U1.E1(GFC2/IO67PPB5V0)
DAC_D1: U1.F3(GFB2/IO68NDB5V0)
DAC_D2: U1.G4(GFC1/IO66PPB5V0)
DAC_D3: U1.H5(GFC0/IO66NPB5V0)
DAC_D4: U1.H6(GFA1/IO64PDB5V0)
DAC_D5: U1.J6(GFA0/IO64NDB5V0)
DAC_D6: U1.B22(GBA2/IO20PDB1V0)
DAC_D7: U1.C22(GBB2/IO20NDB1V0)
DAC_DACEN: U1.F1(GFB1/IO65PPB5V0) ; port DAC_DACEN
DAC_PD: U1.G2(GFB0/IO65NPB5V0) ; port DAC_PD
RF_~{CS}: U1.H20(GCC0/IO26NPB1V0) ; port RF_~{CS}
RF_DIN: U1.J22(GCB1/IO27PDB1V0) ; port RF_DIN
RF_~{RX}/TX: U1.L18(GDA2/IO33NDB1V0) ; port RF_~{RX}/TX
RF_~{SHDN}: U1.M18(GDB2/IO33PDB1V0) ; port RF_~{SHDN}
RF_SCLK: U1.L22(GDC2/IO32PDB1V0) ; port RF_SCLK
RSSI_~{CS}: U1.H17(IO25NDB1V0) ; port RSSI_~{CS}
RSSI_SCLK: U1.H18(GCC2/IO25PDB1V0) ; port RSSI_SCLK
RSSI_SDATA: U1.H22(GCB0/IO27NDB1V0) ; port RSSI_SDATA
RTC_INT: U1.B7(N12) ; port RTC_INT
USER_IO0: P8.1 U1.N6(W1)
USER_IO1: P8.2 U1.M6(W2)
USER_IO2: P8.3 U1.P1(W3)
USER_IO3: P8.4 U1.P2(W4)
USER_IO4: P8.5 U1.N3(W5)
USER_IO5: P8.6 U1.N2(W6)
USER_IO6: P8.7 U1.M2(W7)
USER_IO7: P8.8 U1.M1(W8)
USER_IO8: P8.9 U1.M4(W9)
USER_IO9: P8.10 U1.L3(W10)
USER_IO10: P8.11 U1.L2(W11)
USER_IO11: P8.12 U1.L1(W12)
USER_IO12: P8.13 U1.L5(W13)
USER_IO13: P8.14 U1.K4(W14)
USER_IO14: P8.15 U1.L6(W15)
USER_IO15: P8.16 U1.K6(W16)
USER_LED0: R66.1 U1.J20(GCA1/IO28PDB1V0)
USER_LED1: R65.1 U1.J19(GCA0/IO28NDB1V0)
USER_LED2: R64.1 U1.K20(GDC1/IO29PDB1V0)
USER_LED3: R63.1 U1.K21(GDC0/IO29NDB1V0)
USER_LED4: R62.1 U1.L20(GDB1/IO30PDB1V0)
USER_LED5: R61.1 U1.L21(GDB0/IO30NDB1V0)
USER_LED6: R60.1 U1.K18(GDA1/IO31PDB1V0)
USER_LED7: R59.1 U1.K19(GDA0/IO31NDB1V0)
NetD1_2: D1.2(K) R66.2
NetD2_2: D2.2(K) R65.2
NetD3_2: D3.2(K) R64.2
NetD4_2: D4.2(K) R63.2
NetD5_2: D5.2(K) R62.2
NetD6_2: D6.2(K) R61.2
NetD7_2: D7.2(K) R60.2
NetD8_2: D8.2(K) R59.2
NetR55_1: R55.1 SW4.1 SW4.3 U1.E14(GBC0/IO17NPB0V0)
NetR56_1: R56.1 SW3.1 SW3.3 U1.D15(GBC1/IO17PPB0V0)
NetR57_1: R57.1 SW2.1 SW2.3 U1.B19(GBB0/IO18NDB0V0)
NetR58_1: R58.1 SW1.1 SW1.3 U1.J21(GCC1/IO26PPB1V0)

Not connected (* = marked no-connect by the designer): U1 E22(IO22NDB1V0)* F2(IO67NPB5V0)* F22(IO22PDB1V0)* M22(IO32NDB1V0)*

### Buses and harness runs
bus ADC_A[0..7] = port ADC_A[0..7]
bus ADC_B[0..7] = port ADC_B[0..7]
bus B[1..7] = port B[1..7]
bus DAC_D[0..7] = port DAC_D[0..7]

### Notes on the sheet
- (near U1) change assignment
- (near P8) Fabric USER IO
- Title
- Date:
- Author:
- Revision:
- Sheet
- of
- University of Michigan
- File:
- (in symbol F2-200_500-FGG484_1, part H) FPGA_GPIO
- (in symbol F2-200_500-FGG484_1, part J) A2F500 ONLY; FPGA GPIO

### Library data of the parts
D1-D8 = LED2: as D9 on sheet usb_uart; Published: 8-Jun-2000; LatestRevisionDate: 17-Jul-2002; LatestRevisionNote: Re-released for DXP Platform.; PackageVersion: Feb-2002; PackageReference: 3.2X1.6X1.1; Publisher: Altium Limited; PackageDescription: SM LED; 2 Flat Leads
P8 = 2 x 8 header: 100 mils standard header; Supplier 1: Digi-Key; Supplier Part Number 1: 609-3220-ND
R55-R66 = Res3: Resistor; Published: 8-Jun-2000; LatestRevisionDate: 29-May-2009; LatestRevisionNote: IPC-7351 Footprint Added.; PackageReference: J1-0603; Publisher: Altium Limited; PackageDescription: Chip Resistor
  R55-R58: Value: 10K
  R59-R66: Value: 750
SW1-SW4 = Switch 4-lead: Switch; Supplier 1: Digi-Key; Supplier Part Number 1: 401-1776-1-ND; Supplier 2: Digi-Key; Supplier Part Number 2: P8008S-ND
U1 = F2-200_500-FGG484_1: as U1 on sheet EMC; Supplier 1: Mouser

## Sheet MSS_IO.SchDoc: uSDR schematic
size Letter; Author: Ye-sheng Kuo; CompanyName: Univ. of Michigan; Revision: 2.0; SheetNumber: 11; SheetTotal: 16
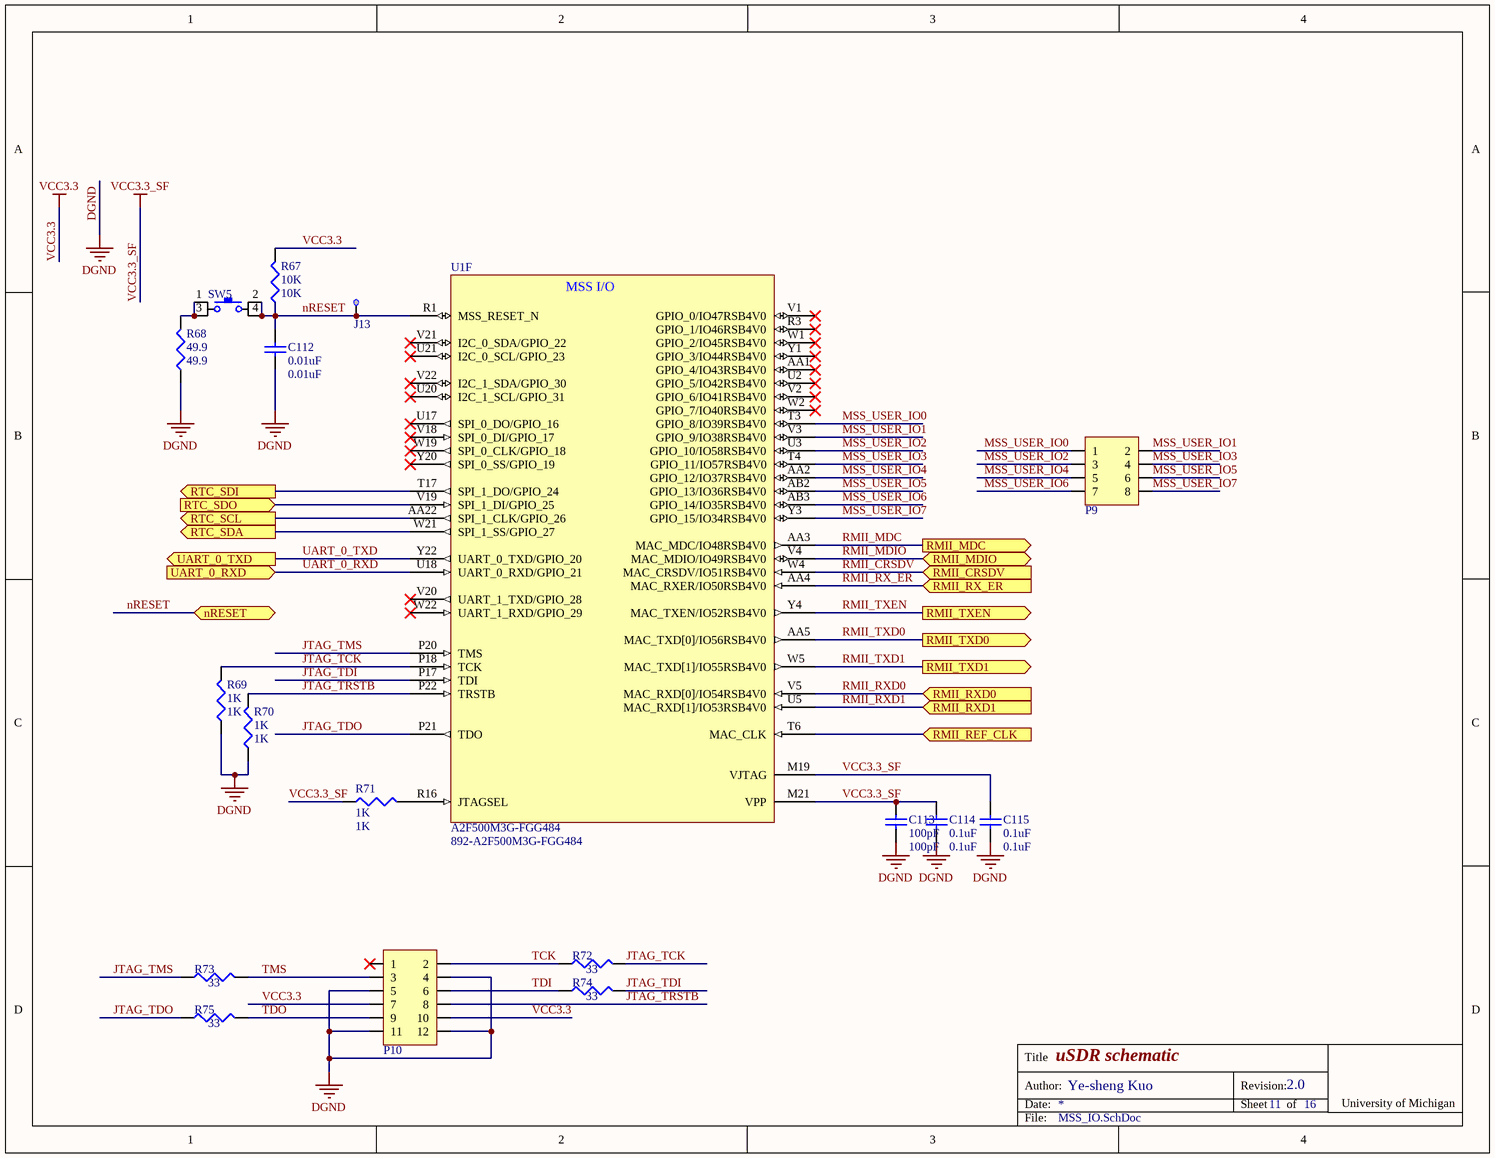
[diagram p8: MSS_IO.SchDoc]

### Parts
C112  0.01uF  [0402]
C113  100pF  [0402]
C114  0.1uF  [0402]
C115  0.1uF  [0402]
J13  5004  [TestPoint]  (value not drawn)
P9  2 x 4 header  [2x4 header]  (value not drawn)
P10  2 x 6 header  [2x6 header, right angle]  (value not drawn)
R67  10K  [0402]
R68  49.9  [0402]
R69  1K  [0402]
R70  1K  [0402]
R71  1K  [0402]
R72  33  [0402]
R73  33  [0402]
R74  33  [0402]
R75  33  [0402]
SW5  Switch 4-lead  [EVQPA PB]  (value not drawn)
U1  A2F500M3G-FGG484  Supplier Part Number 1: 892-A2F500M3G-FGG484  [BGA100P22X22-484N]  (part F of 13)

### Ports
nRESET (bidir), RMII_CRSDV (in), RMII_MDC (out), RMII_MDIO (bidir), RMII_REF_CLK (in), RMII_RX_ER (in), RMII_RXD0 (in), RMII_RXD1 (in), RMII_TXD0 (out), RMII_TXD1 (out), RMII_TXEN (out), RTC_SCL (out), RTC_SDA (out), RTC_SDI (out), RTC_SDO (in), UART_0_RXD (in), UART_0_TXD (out)

### Nets
DGND: C112.1 C113.1 C114.1 C115.1 P10.4 P10.5 P10.11 P10.12 R68.1 R69.1 R70.1
VCC3.3: P10.7 P10.10 R67.2
VCC3.3_SF: C113.2 C114.2 C115.2 R71.1 U1.M19(VJTAG) U1.M21(VPP)
JTAG_TCK: R69.2 R72.2 U1.P18(TCK)
JTAG_TDI: R74.2 U1.P17(TDI)
JTAG_TDO: R75.1 U1.P21(TDO)
JTAG_TMS: R73.1 U1.P20(TMS)
JTAG_TRSTB: P10.8 R70.2 U1.P22(TRSTB)
MSS_USER_IO0: P9.1 U1.T3(GPIO_8/IO39RSB4V0)
MSS_USER_IO1: P9.2 U1.V3(GPIO_9/IO38RSB4V0)
MSS_USER_IO2: P9.3 U1.U3(GPIO_10/IO58RSB4V0)
MSS_USER_IO3: P9.4 U1.T4(GPIO_11/IO57RSB4V0)
MSS_USER_IO4: P9.5 U1.AA2(GPIO_12/IO37RSB4V0)
MSS_USER_IO5: P9.6 U1.AB2(GPIO_13/IO36RSB4V0)
MSS_USER_IO6: P9.7 U1.AB3(GPIO_14/IO35RSB4V0)
MSS_USER_IO7: P9.8 U1.Y3(GPIO_15/IO34RSB4V0)
nRESET: C112.2 J13.1(TB) R67.1 SW5.2 SW5.4 U1.R1(MSS_RESET_N) ; port nRESET
RMII_CRSDV: U1.W4(MAC_CRSDV/IO51RSB4V0) ; port RMII_CRSDV
RMII_MDC: U1.AA3(MAC_MDC/IO48RSB4V0) ; port RMII_MDC
RMII_MDIO: U1.V4(MAC_MDIO/IO49RSB4V0) ; port RMII_MDIO
RMII_REF_CLK: U1.T6(MAC_CLK) ; port RMII_REF_CLK
RMII_RX_ER: U1.AA4(MAC_RXER/IO50RSB4V0) ; port RMII_RX_ER
RMII_RXD0: U1.V5(MAC_RXD[0]/IO54RSB4V0) ; port RMII_RXD0
RMII_RXD1: U1.U5(MAC_RXD[1]/IO53RSB4V0) ; port RMII_RXD1
RMII_TXD0: U1.AA5(MAC_TXD[0]/IO56RSB4V0) ; port RMII_TXD0
RMII_TXD1: U1.W5(MAC_TXD[1]/IO55RSB4V0) ; port RMII_TXD1
RMII_TXEN: U1.Y4(MAC_TXEN/IO52RSB4V0) ; port RMII_TXEN
RTC_SCL: U1.AA22(SPI_1_CLK/GPIO_26) ; port RTC_SCL
RTC_SDA: U1.W21(SPI_1_SS/GPIO_27) ; port RTC_SDA
RTC_SDI: U1.T17(SPI_1_DO/GPIO_24) ; port RTC_SDI
RTC_SDO: U1.V19(SPI_1_DI/GPIO_25) ; port RTC_SDO
TCK: P10.2 R72.1
TDI: P10.6 R74.1
TDO: P10.9 R75.2
TMS: P10.3 R73.2
UART_0_RXD: U1.U18(UART_0_RXD/GPIO_21) ; port UART_0_RXD
UART_0_TXD: U1.Y22(UART_0_TXD/GPIO_20) ; port UART_0_TXD
NetR68_2: R68.2 SW5.1 SW5.3
NetR71_2: R71.2 U1.R16(JTAGSEL)

Not connected (* = marked no-connect by the designer): P10 1*; U1 AA1(GPIO_4/IO43RSB4V0)* R3(GPIO_1/IO46RSB4V0)* U2(GPIO_5/IO42RSB4V0)* U17(SPI_0_DO/GPIO_16)* U20(I2C_1_SCL/GPIO_31)* U21(I2C_0_SCL/GPIO_23)* V1(GPIO_0/IO47RSB4V0)* V2(GPIO_6/IO41RSB4V0)* V18(SPI_0_DI/GPIO_17)* V20(UART_1_TXD/GPIO_28)* V21(I2C_0_SDA/GPIO_22)* V22(I2C_1_SDA/GPIO_30)* W1(GPIO_2/IO45RSB4V0)* W2(GPIO_7/IO40RSB4V0)* W19(SPI_0_CLK/GPIO_18)* W22(UART_1_RXD/GPIO_29)* Y1(GPIO_3/IO44RSB4V0)* Y20(SPI_0_SS/GPIO_19)*

### Notes on the sheet
- Title
- Date:
- Author:
- Revision:
- Sheet
- of
- University of Michigan
- File:
- (in symbol F2-200_500-FGG484_1, part F) MSS I/O

### Library data of the parts
C112-C115 = Cap Semi: Capacitor (Semiconductor SIM Model); Published: 8-Jun-2000; LatestRevisionDate: 29-May-2009; LatestRevisionNote: IPC-7351 Footprint Added.; PackageReference: C1206; Publisher: Altium Limited; PackageDescription: Chip Capacitor
  C112: Value: 0.01uF
  C113: Value: 100pF
  C114 C115: Value: 0.1uF
J13 = TestPoint: TEST POINT PC MINI .040"D YELLOW; Supplier 1: Digi-Key; Supplier Part Number 1: 5004K-ND; datasheet: http://mail.keyelco.com/ENG._DEPT/PDF%20CAT%20NO%20Drawings/5004.pdf
P9 = 2 x 4 header: 100 mils standard header; Supplier 1: Digi-Key; Supplier Part Number 1: 609-3226-ND
P10 = 2 x 6 header: 100 mils standard header; Supplier 1: Digi-Key; Supplier Part Number 1: 609-3345-ND
R67-R75 = Res3: Resistor; Published: 8-Jun-2000; LatestRevisionDate: 29-May-2009; LatestRevisionNote: IPC-7351 Footprint Added.; PackageReference: J1-0603; Publisher: Altium Limited; PackageDescription: Chip Resistor
  R67: Value: 10K
  R68: Value: 49.9
  R69-R71: Value: 1K
  R72-R75: Value: 33
SW5 = Switch 4-lead: Switch; Supplier 1: Digi-Key; Supplier Part Number 1: 401-1776-1-ND; Supplier 2: Digi-Key; Supplier Part Number 2: P8008S-ND
U1 = F2-200_500-FGG484_1: as U1 on sheet EMC; Supplier 1: Mouser

## Sheet ADC.SchDoc: uSDR schematic
size Letter; Author: Ye-sheng Kuo; CompanyName: Univ. of Michigan; Revision: 2.0; SheetNumber: 3; SheetTotal: 16
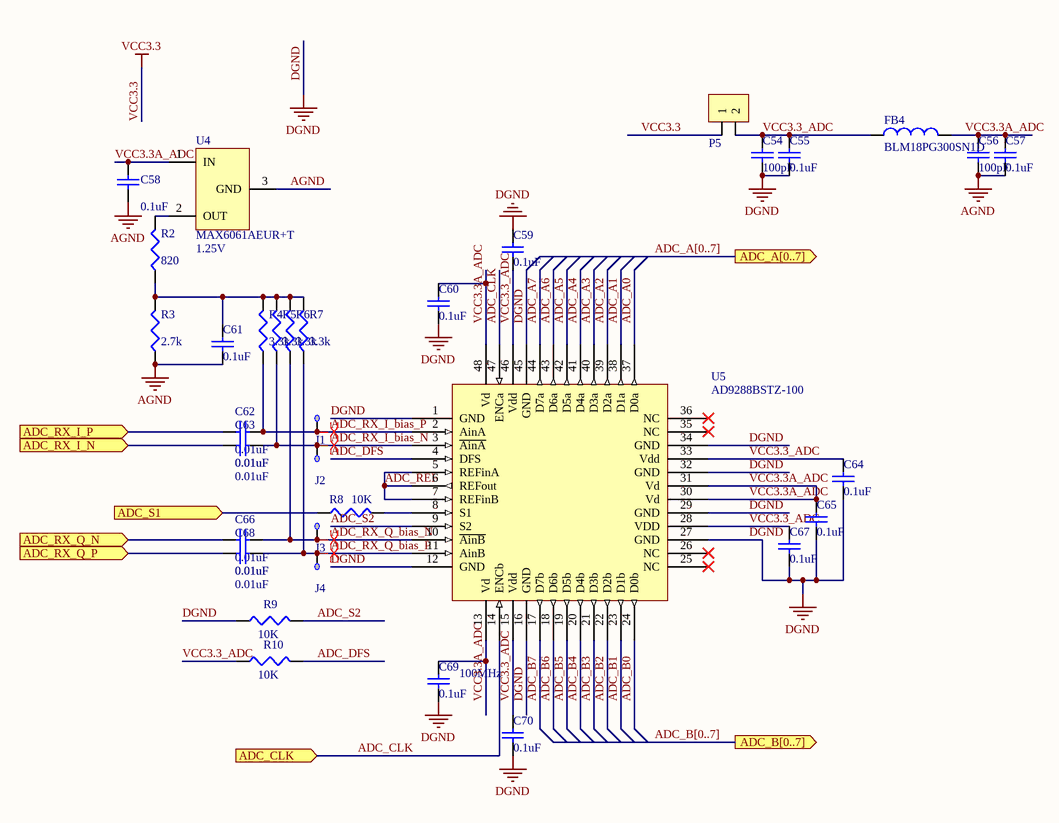
[diagram p9: ADC.SchDoc]

### Parts
C54  100pF  [0402]
C55  0.1uF  [0402]
C56  100pF  [0402]
C57  0.1uF  [0402]
C58  0.1uF  [0402]
C59  0.1uF  [0402]
C60  0.1uF  [0402]
C61  0.1uF  [0402]
C62  0.01uF  [0402]
C63  0.01uF  [0402]
C64  0.1uF  [0402]
C65  0.1uF  [0402]
C66  0.01uF  [0402]
C67  0.1uF  [0402]
C68  0.01uF  [0402]
C69  0.1uF  [0402]
C70  0.1uF  [0402]
FB4  BLM18PG300SN1D  [1608[0603]]
J1  5004  [TestPoint]  (value not drawn)
J2  5004  [TestPoint]  (value not drawn)
J3  5004  [TestPoint]  (value not drawn)
J4  5004  [TestPoint]  (value not drawn)
P5  1 x 2 header  [1x2 header]  (value not drawn)
R2  820  [0402]
R3  2.7K  [0402]
R4  3.3K  [0402]
R5  3.3K  [0402]
R6  3.3K  [0402]
R7  3.3K  [0402]
R8  10K  [0402]
R9  10K  [0402]
R10  10K  [0402]
U4  MAX6061AEUR+T  value 1.25V  [SOT23-3N]
U5  AD9288BSTZ-100  value 100MHz  [TSQFP50P900X900X160-48N]

### Ports
ADC_A[0..7] (out), ADC_B[0..7] (out), ADC_CLK (in), ADC_RX_I_N (in), ADC_RX_I_P (in), ADC_RX_Q_N (in), ADC_RX_Q_P (in), ADC_S1 (in)

### Nets
AGND: C56.1 C57.1 C58.1 C61.1 R3.1 U4.3(GND)
DGND: C54.1 C55.1 C59.2 C60.1 C64.1 C65.1 C67.1 C69.1 C70.1 R9.1 U5.1(GND) U5.12(GND) U5.16(GND) U5.27(GND) U5.29(GND) U5.32(GND) U5.34(GND) U5.45(GND)
VCC3.3: P5.1
ADC_A0: U5.37(D0a)
ADC_A1: U5.38(D1a)
ADC_A2: U5.39(D2a)
ADC_A3: U5.40(D3a)
ADC_A4: U5.41(D4a)
ADC_A5: U5.42(D5a)
ADC_A6: U5.43(D6a)
ADC_A7: U5.44(D7a)
ADC_B0: U5.24(D0b)
ADC_B1: U5.23(D1b)
ADC_B2: U5.22(D2b)
ADC_B3: U5.21(D3b)
ADC_B4: U5.20(D4b)
ADC_B5: U5.19(D5b)
ADC_B6: U5.18(D6b)
ADC_B7: U5.17(D7b)
ADC_CLK: U5.14(ENCb) U5.47(ENCa) ; port ADC_CLK
ADC_DFS: R10.2 U5.4(DFS)
ADC_REF: U5.5(REFinA) U5.6(REFout) U5.7(REFinB)
ADC_RX_I_bias_N: C63.2 J2.1(TB) R5.1 U5.3(~{AinA})
ADC_RX_I_bias_P: C62.2 J1.1(TB) R4.1 U5.2(AinA)
ADC_RX_I_N: C63.1 ; port ADC_RX_I_N
ADC_RX_I_P: C62.1 ; port ADC_RX_I_P
ADC_RX_Q_bias_N: C66.2 J3.1(TB) R6.1 U5.10(~{AinB})
ADC_RX_Q_bias_P: C68.2 J4.1(TB) R7.1 U5.11(AinB)
ADC_RX_Q_N: C66.1 ; port ADC_RX_Q_N
ADC_RX_Q_P: C68.1 ; port ADC_RX_Q_P
ADC_S1: R8.1 ; port ADC_S1
ADC_S2: R9.2 U5.9(S2)
VCC3.3_ADC: C54.2 C55.2 C59.1 C64.2 C67.2 C70.2 FB4.1 P5.2 R10.1 U5.15(Vdd) U5.28(VDD) U5.33(Vdd) U5.46(Vdd)
VCC3.3A_ADC: C56.2 C57.2 C58.2 C60.2 C65.2 C69.2 FB4.2 U4.1(IN) U5.13(Vd) U5.30(Vd) U5.31(Vd) U5.48(Vd)
NetC61_2: C61.2 R2.1 R3.2 R4.2 R5.2 R6.2 R7.2
NetR2_2: R2.2 U4.2(OUT)
NetR8_2: R8.2 U5.8(S1)

Not connected (* = marked no-connect by the designer): U5 25(NC)* 26(NC)* 35(NC)* 36(NC)*

### Buses and harness runs
bus ADC_A[0..7] = port ADC_A[0..7]
bus ADC_B[0..7] = port ADC_B[0..7]

### Layout directives
differential pair: ADC_RX_I_bias_N, ADC_RX_I_bias_P, ADC_RX_Q_bias_N, ADC_RX_Q_bias_P

### Notes on the sheet
- Title
- Date:
- Author:
- Revision:
- Sheet
- of
- University of Michigan
- File:

### Library data of the parts
C54-C70 = Cap Semi: Capacitor (Semiconductor SIM Model); Published: 8-Jun-2000; LatestRevisionDate: 29-May-2009; LatestRevisionNote: IPC-7351 Footprint Added.; PackageReference: C1206; Publisher: Altium Limited; PackageDescription: Chip Capacitor
  C54 C56: Value: 100pF
  C55 C57-C61 C64 C65 C67 C69 C70: Value: 0.1uF
  C62 C63 C66 C68: Value: 0.01uF
FB4 = Ferrite Bead: FERRITE CHIP 30 OHM 1000MA 0603; Supplier 1: Digi-Key; Supplier Part Number 1: 490-1035-2-ND
J1-J4 = TestPoint: TEST POINT PC MINI .040"D YELLOW; Supplier 1: Digi-Key; Supplier Part Number 1: 5004K-ND; datasheet: http://mail.keyelco.com/ENG._DEPT/PDF%20CAT%20NO%20Drawings/5004.pdf
P5 = 1 x 2 header: 100 mils standard header
R2-R10 = Res3: Resistor; Published: 8-Jun-2000; LatestRevisionDate: 29-May-2009; LatestRevisionNote: IPC-7351 Footprint Added.; PackageReference: J1-0603; Publisher: Altium Limited; PackageDescription: Chip Resistor
  R2: Value: 820
  R3: Value: 2.7k
  R4-R7: Value: 3.3k
  R8-R10: Value: 10K
U4 = MAX6061: IC REF VOLT LDO SOT23-3; Supplier 1: Digi-Key; Supplier Part Number 1: MAX6061AEUR+TCT-ND
U5 = AD9288: IC ADC 8BIT DUAL 100MSPS 48-LQFP; Supplier 1: Digi-Key; Supplier Part Number 1: AD9288BSTZ-100-ND